# EAGLE design bbb-cc2520 (EAGLE 6.5.0)
AUTHOR: Neal Jackson; REV: B; TITLE: Zigbeag

## Sheet 1 of 5
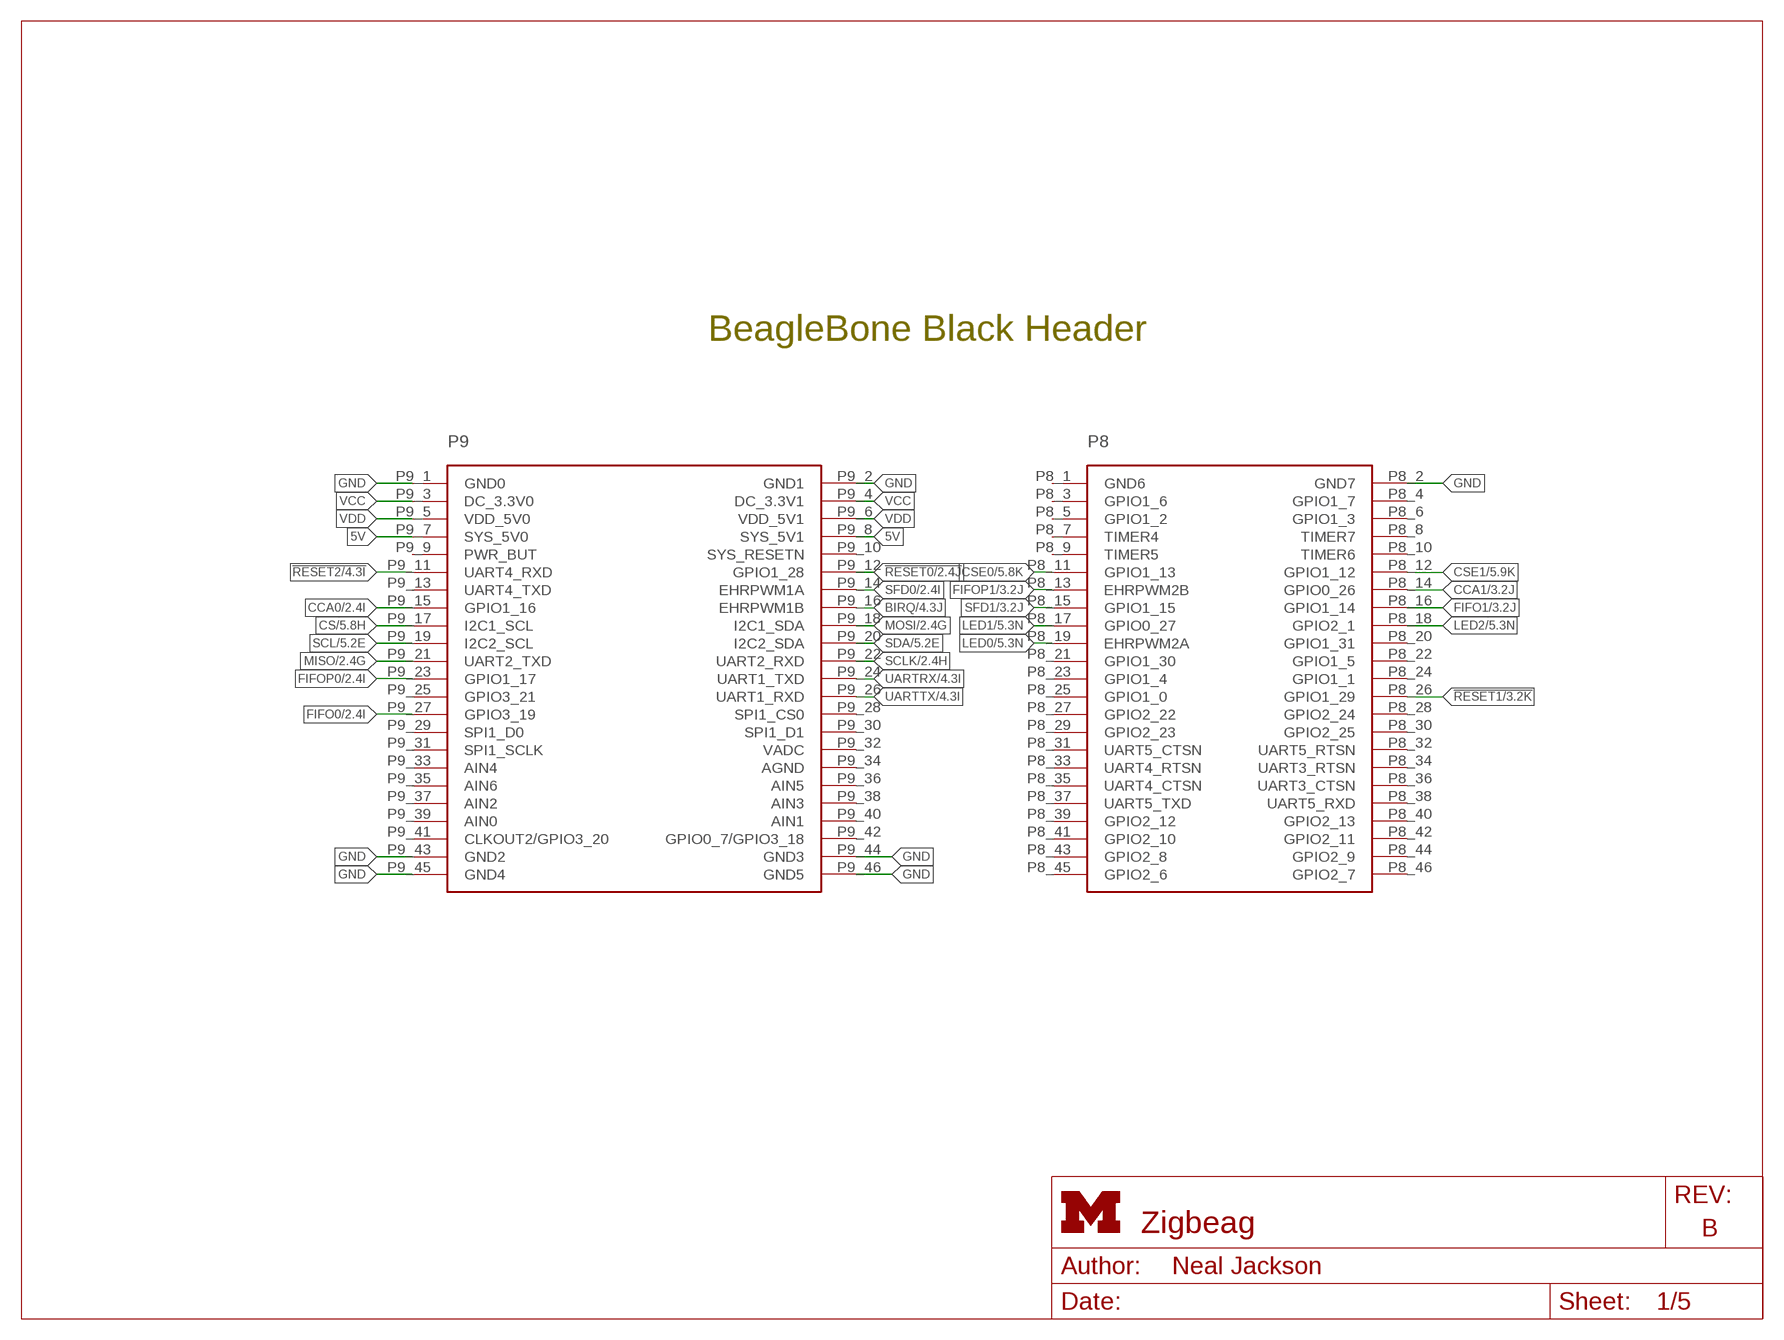
[diagram p0: schematic, sheet 1]
FRAME1 (LETTER_L): HEIGHT: 8.5in; WIDTH: 11in

### Parts
P9/P8  BBB_HEADERS  [BBB_HEADERS]

### Nets
5V: P9/P8.P9_7(SYS_5V0) P9/P8.P9_8(SYS_5V1)
!RESET0: P9/P8.P9_12(GPIO1_28) ; also sheet 2
!RESET1: P9/P8.P8_26(GPIO1_29) ; also sheet 3
!RESET2: P9/P8.P9_11(UART4_RXD) ; also sheet 4
BIRQ: P9/P8.P9_16(EHRPWM1B) ; also sheet 4
CCA0: P9/P8.P9_15(GPIO1_16) ; also sheet 2
CCA1: P9/P8.P8_14(GPIO0_26) ; also sheet 3
CS: P9/P8.P9_17(I2C1_SCL) ; also sheet 5
CSE0: P9/P8.P8_11(GPIO1_13) ; also sheet 5
CSE1: P9/P8.P8_12(GPIO1_12) ; also sheet 5
FIFO0: P9/P8.P9_27(GPIO3_19) ; also sheet 2
FIFO1: P9/P8.P8_16(GPIO1_14) ; also sheet 3
FIFOP0: P9/P8.P9_23(GPIO1_17) ; also sheet 2
FIFOP1: P9/P8.P8_13(EHRPWM2B) ; also sheet 3
GND: P9/P8.P8_2(GND7) P9/P8.P9_1(GND0) P9/P8.P9_2(GND1) P9/P8.P9_43(GND2) P9/P8.P9_44(GND3) P9/P8.P9_45(GND4) P9/P8.P9_46(GND5) ; also sheet 2,3,4,5
LED0: P9/P8.P8_19(EHRPWM2A) ; also sheet 5
LED1: P9/P8.P8_17(GPIO0_27) ; also sheet 5
LED2: P9/P8.P8_18(GPIO2_1) ; also sheet 5
MISO: P9/P8.P9_21(UART2_TXD) ; also sheet 2,3,4
MOSI: P9/P8.P9_18(I2C1_SDA) ; also sheet 2,3,4
SCL: P9/P8.P9_19(I2C2_SCL) ; also sheet 5
SCLK: P9/P8.P9_22(UART2_RXD) ; also sheet 2,3,4
SDA: P9/P8.P9_20(I2C2_SDA) ; also sheet 5
SFD0: P9/P8.P9_14(EHRPWM1A) ; also sheet 2
SFD1: P9/P8.P8_15(GPIO1_15) ; also sheet 3
UARTRX: P9/P8.P9_24(UART1_TXD) ; also sheet 4
UARTTX: P9/P8.P9_26(UART1_RXD) ; also sheet 4
VCC: P9/P8.P9_3(DC_3.3V0) P9/P8.P9_4(DC_3.3V1) ; also sheet 2,3,4,5
VDD: P9/P8.P9_5(VDD_5V0) P9/P8.P9_6(VDD_5V1)
Unconnected: P9/P8.P8_1(GND6) P9/P8.P8_3(GPIO1_6) P9/P8.P8_4(GPIO1_7) P9/P8.P8_5(GPIO1_2) P9/P8.P8_6(GPIO1_3) P9/P8.P8_7(TIMER4) P9/P8.P8_8(TIMER7) P9/P8.P8_9(TIMER5) P9/P8.P8_10(TIMER6) P9/P8.P8_20(GPIO1_31) P9/P8.P8_21(GPIO1_30) P9/P8.P8_22(GPIO1_5) P9/P8.P8_23(GPIO1_4) P9/P8.P8_24(GPIO1_1) P9/P8.P8_25(GPIO1_0) P9/P8.P8_27(GPIO2_22) P9/P8.P8_28(GPIO2_24) P9/P8.P8_29(GPIO2_23) P9/P8.P8_30(GPIO2_25) P9/P8.P8_31(UART5_CTSN) P9/P8.P8_32(UART5_RTSN) P9/P8.P8_33(UART4_RTSN) P9/P8.P8_34(UART3_RTSN) P9/P8.P8_35(UART4_CTSN) P9/P8.P8_36(UART3_CTSN) P9/P8.P8_37(UART5_TXD) P9/P8.P8_38(UART5_RXD) P9/P8.P8_39(GPIO2_12) P9/P8.P8_40(GPIO2_13) P9/P8.P8_41(GPIO2_10) P9/P8.P8_42(GPIO2_11) P9/P8.P8_43(GPIO2_8) P9/P8.P8_44(GPIO2_9) P9/P8.P8_45(GPIO2_6) P9/P8.P8_46(GPIO2_7) P9/P8.P9_9(PWR_BUT) P9/P8.P9_10(SYS_RESETN) P9/P8.P9_13(UART4_TXD) P9/P8.P9_25(GPIO3_21) P9/P8.P9_28(SPI1_CS0) P9/P8.P9_29(SPI1_D0) P9/P8.P9_30(SPI1_D1) P9/P8.P9_31(SPI1_SCLK) P9/P8.P9_32(VADC) P9/P8.P9_33(AIN4) P9/P8.P9_34(AGND) P9/P8.P9_35(AIN6) P9/P8.P9_36(AIN5) P9/P8.P9_37(AIN2) P9/P8.P9_38(AIN3) P9/P8.P9_39(AIN0) P9/P8.P9_40(AIN1) P9/P8.P9_41(CLKOUT2/GPIO3_20) P9/P8.P9_42(GPIO0_7/GPIO3_18)

### Notes on the sheet
- BeagleBone Black Header

## Sheet 2 of 5
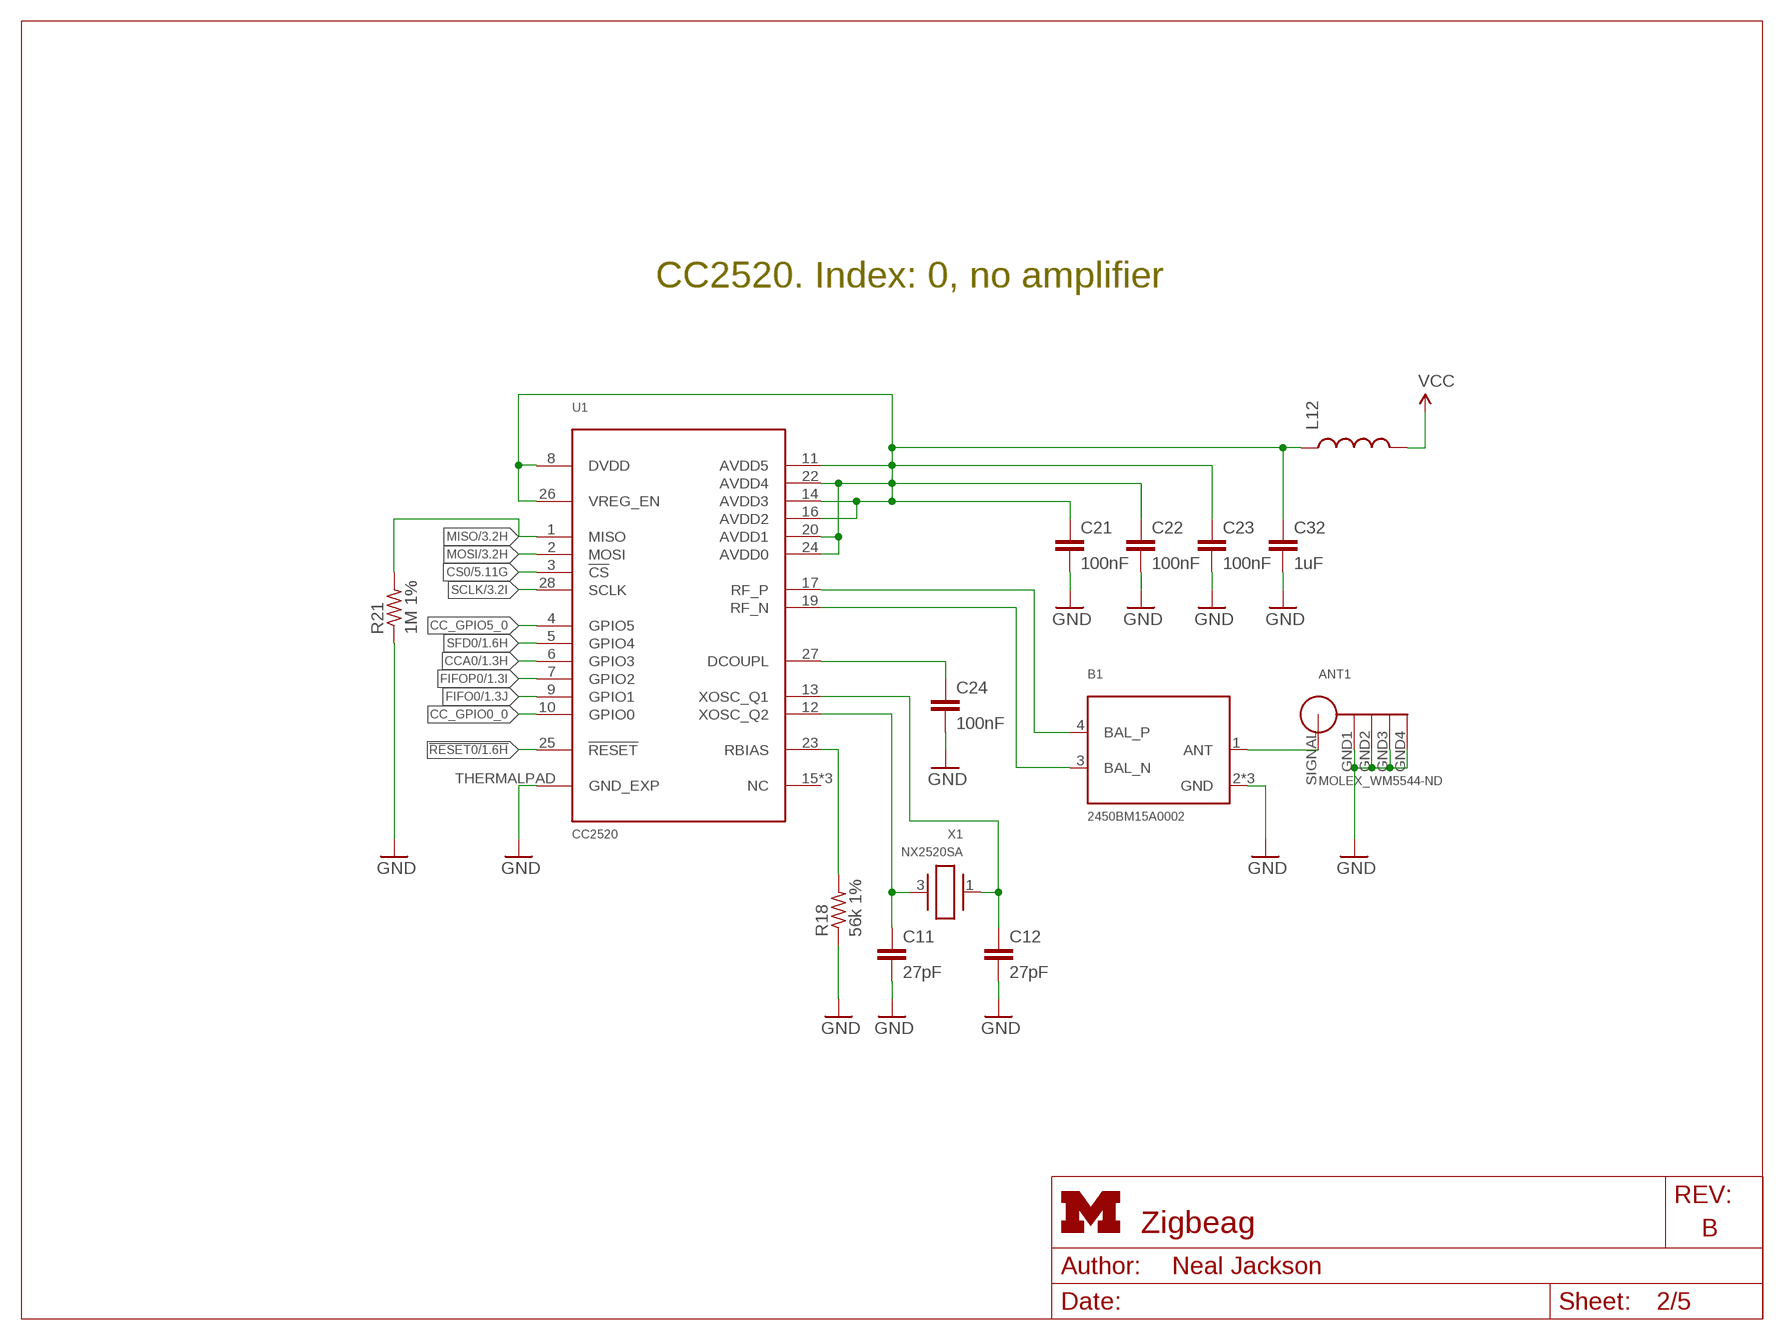
[diagram p1: schematic, sheet 2]
FRAME6 (LETTER_L): HEIGHT: 8.5in; WIDTH: 11in

### Parts
ANT1  MOLEX_WM5544-ND  [MOLEX_WM5544-ND]
B1  2450BM15A0002  [2450BM]
C11  27pF  C-EUC0402  [C0402]
C12  27pF  C-EUC0402  [C0402]
C21  100nF  C-EUC0402  [C0402]
C22  100nF  C-EUC0402  [C0402]
C23  100nF  C-EUC0402  [C0402]
C24  100nF  C-EUC0402  [C0402]
C32  1uF  C-EUC0603  [C0603]
L12  INDUCTOR0603  [0603]
R18  56k 1%  R-US_R0402  [R0402]
R21  1M 1%  R-US_R0402  [R0402]
U1  CC2520  [S-PVQFN-N28]
X1  NX2520SA  [NX2520SA]

### Nets
!RESET0: U1.25(!RESET) ; also sheet 1
CC_GPIO0_0: U1.10(GPIO0)
CC_GPIO5_0: U1.4(GPIO5)
CCA0: U1.6(GPIO3) ; also sheet 1
CS0: U1.3(!CS) ; also sheet 5
FIFO0: U1.9(GPIO1) ; also sheet 1
FIFOP0: U1.7(GPIO2) ; also sheet 1
GND: ANT1.GND1 ANT1.GND2 ANT1.GND3 ANT1.GND4 B1.2(GND) B1.5(GND) B1.6(GND) C11.2 C12.2 C21.2 C22.2 C23.2 C24.2 C32.2 R18.1 R21.1 U1.THERMALPAD(GND_EXP) ; also sheet 1,3,4,5
MISO: R21.2 U1.1(MISO) ; also sheet 1,3,4
MOSI: U1.2(MOSI) ; also sheet 1,3,4
N$5: C21.1 C22.1 C23.1 C32.1 L12.1 U1.8(DVDD) U1.11(AVDD5) U1.14(AVDD3) U1.16(AVDD2) U1.20(AVDD1) U1.22(AVDD4) U1.24(AVDD0) U1.26(VREG_EN)
N$7: ANT1.SIGNAL B1.1(ANT)
N$11: C12.1 U1.13(XOSC_Q1) X1.1
N$12: C24.1 U1.27(DCOUPL)
N$13: C11.1 U1.12(XOSC_Q2) X1.3
N$14: R18.2 U1.23(RBIAS)
RF_N: B1.3(BAL_N) U1.19(RF_N)
RF_P: B1.4(BAL_P) U1.17(RF_P)
SCLK: U1.28(SCLK) ; also sheet 1,3,4
SFD0: U1.5(GPIO4) ; also sheet 1
VCC: L12.2 ; also sheet 1,3,4,5
Unconnected: U1.15(NC) U1.18(NC) U1.21(NC)

### Notes on the sheet
- CC2520. Index: 0, no amplifier

## Sheet 3 of 5
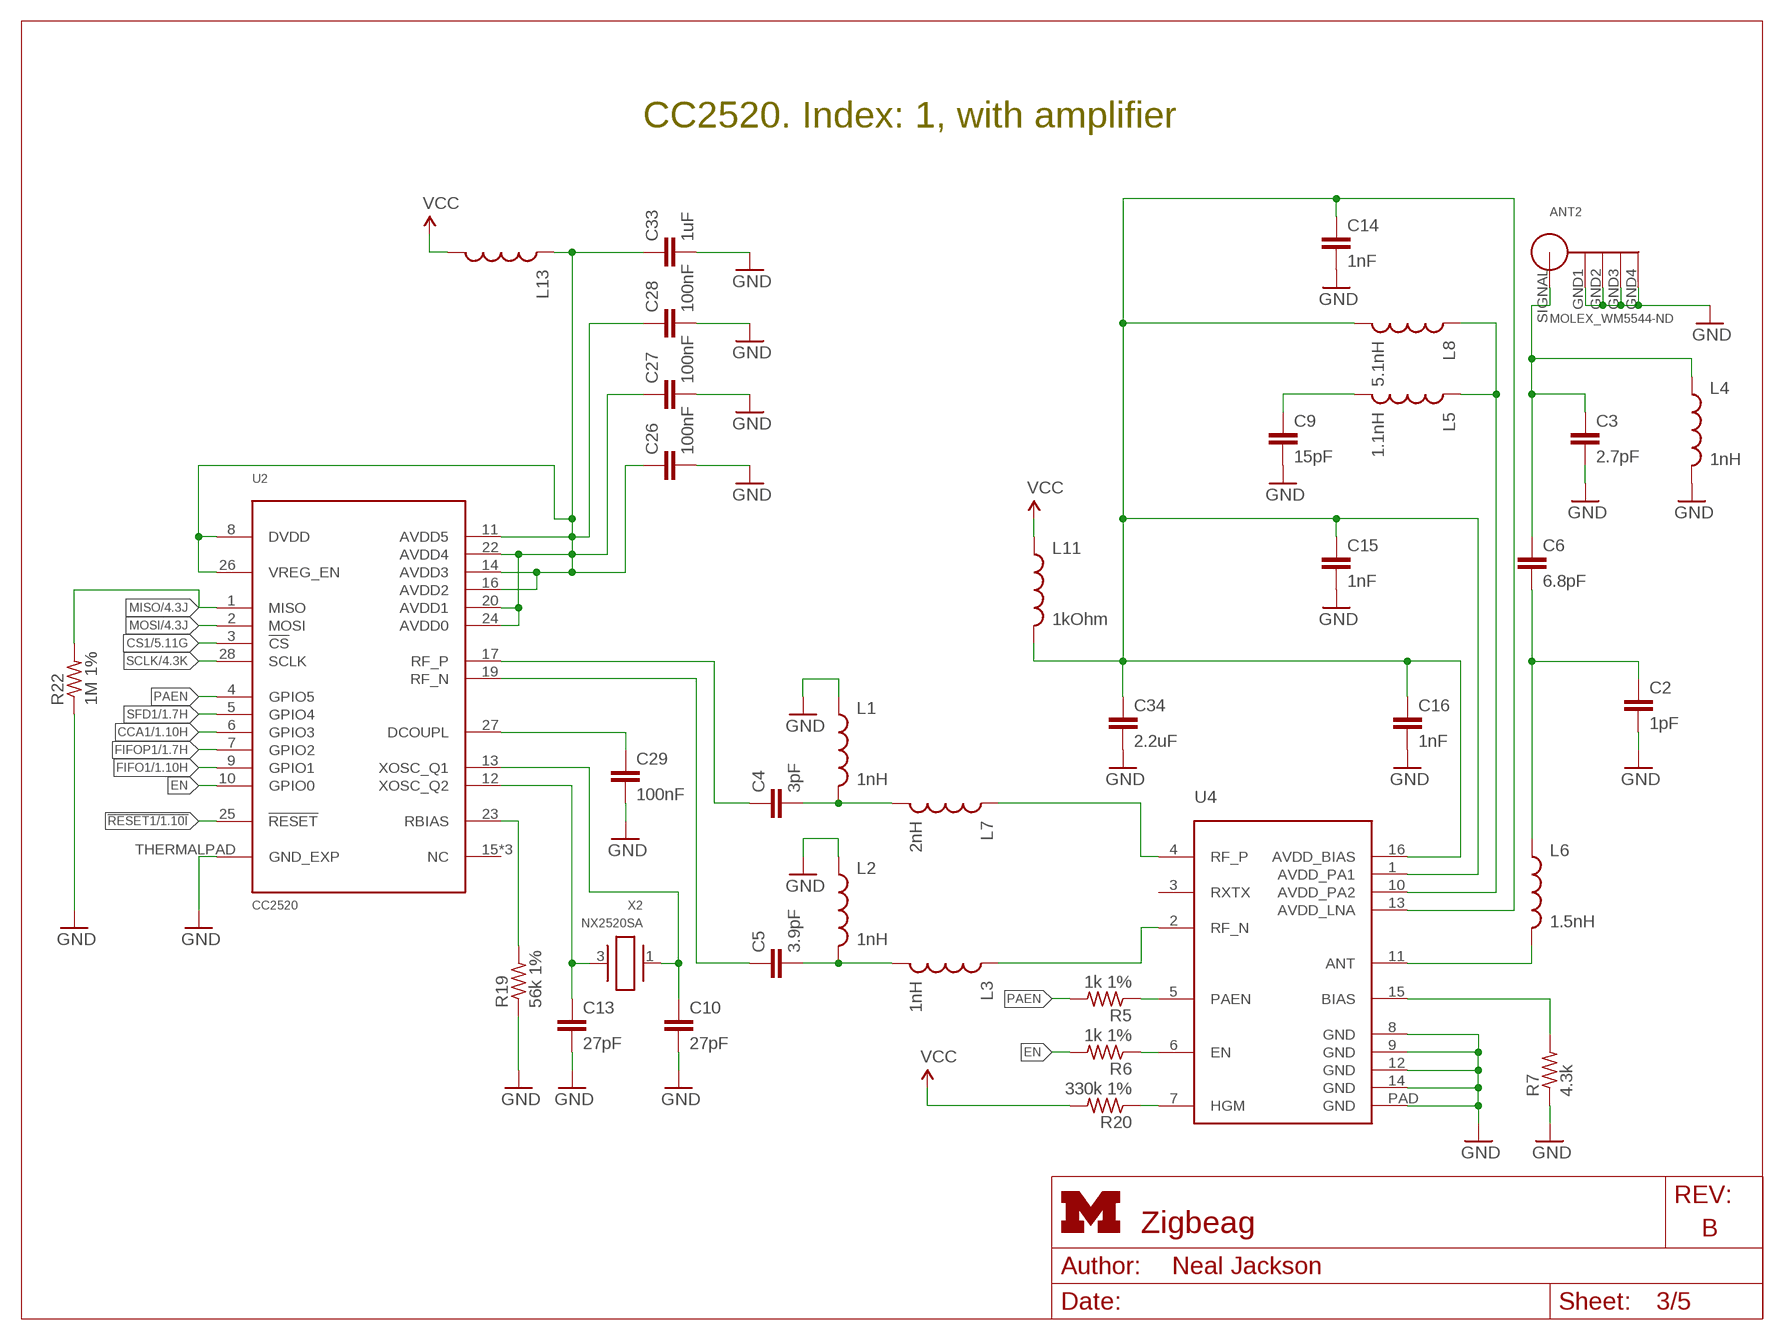
[diagram p2: schematic, sheet 3]
FRAME3 (LETTER_L): HEIGHT: 8.5in; WIDTH: 11in

### Parts
ANT2  MOLEX_WM5544-ND  [MOLEX_WM5544-ND]
C2  1pF  C-EUC0402  [C0402]
C3  2.7pF  C-EUC0402  [C0402]
C4  3pF  C-EUC0402  [C0402]
C5  3.9pF  C-EUC0402  [C0402]
C6  6.8pF  C-EUC0402  [C0402]
C9  15pF  C-EUC0402  [C0402]
C10  27pF  C-EUC0402  [C0402]
C13  27pF  C-EUC0402  [C0402]
C14  1nF  C-EUC0402  [C0402]
C15  1nF  C-EUC0402  [C0402]
C16  1nF  C-EUC0402  [C0402]
C26  100nF  C-EUC0402  [C0402]
C27  100nF  C-EUC0402  [C0402]
C28  100nF  C-EUC0402  [C0402]
C29  100nF  C-EUC0402  [C0402]
C33  1uF  C-EUC0603  [C0603]
C34  2.2uF  C-EUC0402  [C0402]
L1  1nH  INDUCTOR0402  [C0402]
L2  1nH  INDUCTOR0402  [C0402]
L3  1nH  INDUCTOR0402  [C0402]
L4  1nH  INDUCTOR0402  [C0402]
L5  1.1nH  INDUCTOR0402  [C0402]
L6  1.5nH  INDUCTOR0402  [C0402]
L7  2nH  INDUCTOR0402  [C0402]
L8  5.1nH  INDUCTOR0402  [C0402]
L11  1kOhm  INDUCTOR0402  [C0402]
L13  INDUCTOR0603  [0603]
R5  1k 1%  R-US_R0402  [R0402]
R6  1k 1%  R-US_R0402  [R0402]
R7  4.3k  R-US_R0402  [R0402]
R19  56k 1%  R-US_R0402  [R0402]
R20  330k 1%  R-US_R0402  [R0402]
R22  1M 1%  R-US_R0402  [R0402]
U2  CC2520  [S-PVQFN-N28]
U4  CC2591  [PVQFN-16]
X2  NX2520SA  [NX2520SA]

### Nets
!RESET1: U2.25(!RESET) ; also sheet 1
CCA1: U2.6(GPIO3) ; also sheet 1
CS1: U2.3(!CS) ; also sheet 5
EN: R6.2 U2.10(GPIO0)
FIFO1: U2.9(GPIO1) ; also sheet 1
FIFOP1: U2.7(GPIO2) ; also sheet 1
GND: ANT2.GND1 ANT2.GND2 ANT2.GND3 ANT2.GND4 C2.2 C3.2 C9.2 C10.2 C13.2 C14.2 C15.2 C16.2 C26.2 C27.2 C28.2 C29.2 C33.2 C34.2 L1.1 L2.1 L4.2 R7.1 R19.1 R22.1 U2.THERMALPAD(GND_EXP) U4.8(GND) U4.9(GND) U4.12(GND) U4.14(GND) U4.PAD(GND) ; also sheet 1,2,4,5
MISO: R22.2 U2.1(MISO) ; also sheet 1,2,4
MOSI: U2.2(MOSI) ; also sheet 1,2,4
N$44: L7.1 U4.4(RF_P)
N$45: L3.1 U4.2(RF_N)
N$46: C5.2 L2.2 L3.2
N$47: C4.2 L1.2 L7.2
N$48: L5.1 L8.1 U4.10(AVDD_PA2)
N$49: C14.1 C15.1 C16.1 C34.1 L8.2 L11.2 U4.1(AVDD_PA1) U4.13(AVDD_LNA) U4.16(AVDD_BIAS)
N$50: C9.1 L5.2
N$51: L6.2 U4.11(ANT)
N$52: ANT2.SIGNAL C3.1 C6.1 L4.1
N$53: C2.1 C6.2 L6.1
N$54: R7.2 U4.15(BIAS)
N$55: R5.1 U4.5(PAEN)
N$56: R6.1 U4.6(EN)
N$57: C26.1 C27.1 C28.1 C33.1 L13.1 U2.8(DVDD) U2.11(AVDD5) U2.14(AVDD3) U2.16(AVDD2) U2.20(AVDD1) U2.22(AVDD4) U2.24(AVDD0) U2.26(VREG_EN)
N$58: C29.1 U2.27(DCOUPL)
N$59: C10.1 U2.13(XOSC_Q1) X2.1
N$60: C13.1 U2.12(XOSC_Q2) X2.3
N$61: R19.2 U2.23(RBIAS)
N$62: R20.1 U4.7(HGM)
PAEN: R5.2 U2.4(GPIO5)
RF_N2: C5.1 U2.19(RF_N)
RF_P2: C4.1 U2.17(RF_P)
SCLK: U2.28(SCLK) ; also sheet 1,2,4
SFD1: U2.5(GPIO4) ; also sheet 1
VCC: L11.1 L13.2 R20.2 ; also sheet 1,2,4,5
Unconnected: U2.15(NC) U2.18(NC) U2.21(NC) U4.3(RXTX)

### Notes on the sheet
- CC2520. Index: 1, with amplifier

## Sheet 4 of 5
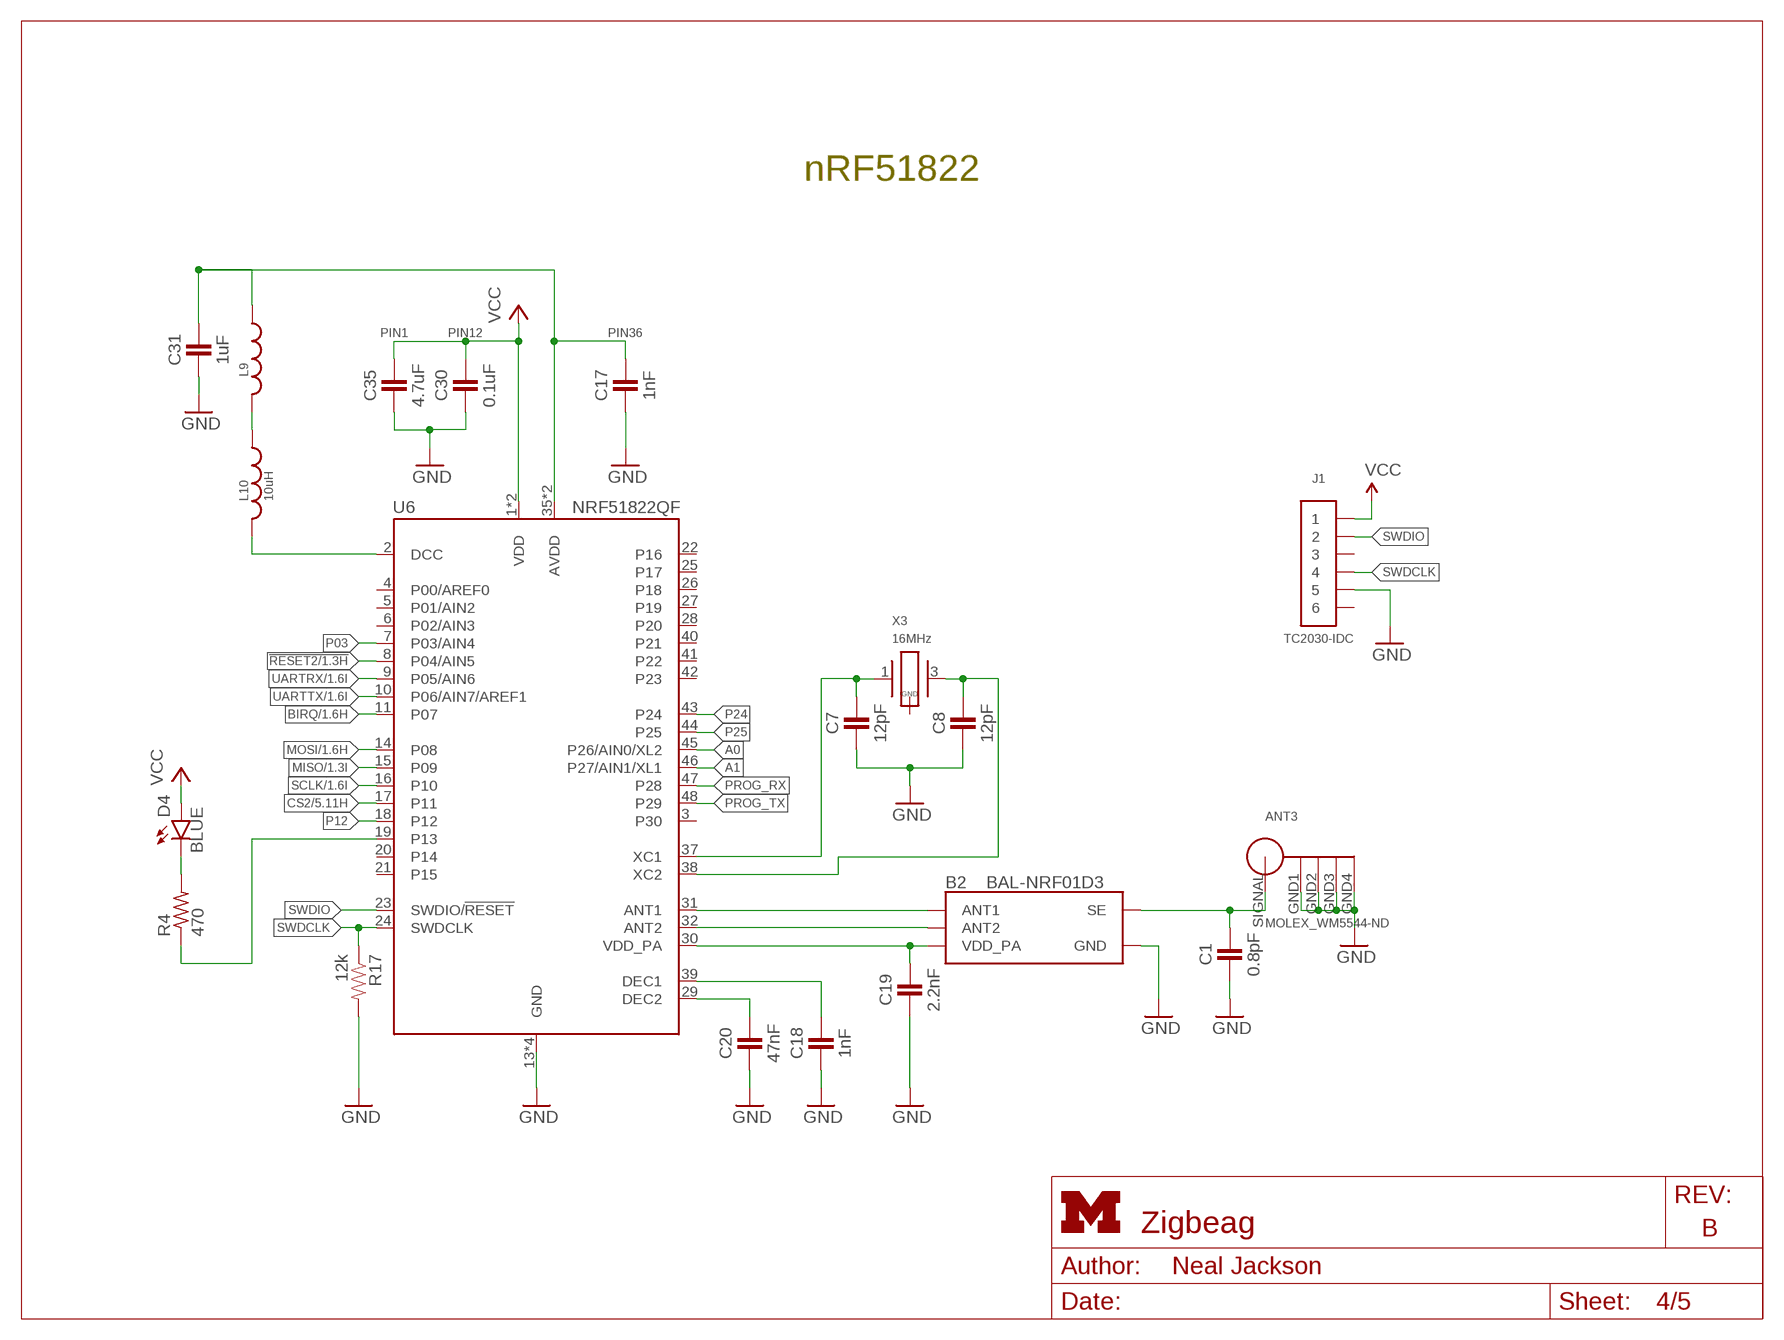
[diagram p3: schematic, sheet 4]
FRAME2 (LETTER_L): HEIGHT: 8.5in; WIDTH: 11in

### Parts
ANT3  MOLEX_WM5544-ND  [MOLEX_WM5544-ND]
B2  BAL-NRF01D3  [BAL-NRF01D3]
C1  0.8pF  CAPACITOR  [0402_CAP]
C7  12pF  CAPACITOR  [0402_CAP]
C8  12pF  CAPACITOR  [0402_CAP]
C17  1nF  CAPACITOR  [0402_CAP]
C18  1nF  CAPACITOR  [0402_CAP]
C19  2.2nF  CAPACITOR  [0402_CAP]
C20  47nF  CAPACITOR  [0402_CAP]
C30  0.1uF  CAPACITOR  [0402_CAP]
C31  1uF  CAPACITOR  [0402_CAP]
C35  4.7uF  CAPACITOR  [0402_CAP]
D4  BLUE  LED0603  [LED-0603]
J1  TC2030-IDC  [TC2030-IDC]
L9  INDUCTOR0402  [0402_CAP]
L10  10uH  INDUCTOR0603  [0603_CAP]
R4  470  R-US_R0402  [R0402]
R17  12k  RESISTOR  [0603-RES]
U6  NRF51822QF  [QFN-48-6MM]
X3  16MHz  TXC-8Y  [TXC-8Y]

### Nets
!RESET2: U6.8(P04/AIN5) ; also sheet 1
A0: U6.45(P26/AIN0/XL2)
A1: U6.46(P27/AIN1/XL1)
AVDD: C17.1 C31.1 L9.1 U6.35(AVDD) U6.36(AVDD)
BIRQ: U6.11(P07) ; also sheet 1
CS2: U6.17(P11) ; also sheet 5
DCC: L10.2 U6.2(DCC)
GND: ANT3.GND1 ANT3.GND2 ANT3.GND3 ANT3.GND4 B2.GND C1.2 C7.2 C8.2 C17.2 C18.2 C19.2 C20.2 C30.2 C31.2 C35.2 J1.5 R17.2 U6.13(GND) U6.33(GND) U6.34(GND) U6.GND ; also sheet 1,2,3,5
MISO: U6.15(P09) ; also sheet 1,2,3
MOSI: U6.14(P08) ; also sheet 1,2,3
N$36: B2.ANT1 U6.31(ANT1)
N$37: B2.ANT2 U6.32(ANT2)
N$38: ANT3.SIGNAL B2.SE C1.1
N$39: L9.2 L10.1
N$40: C7.1 U6.37(XC1) X3.1
N$41: C8.1 U6.38(XC2) X3.3
N$42: C18.1 U6.39(DEC1)
N$43: C20.1 U6.29(DEC2)
N$63: D4.C R4.2
N$64: R4.1 U6.19(P13)
P03: U6.7(P03/AIN4)
P12: U6.18(P12)
P24: U6.43(P24)
P25: U6.44(P25)
PROG_RX: U6.47(P28)
PROG_TX: U6.48(P29)
SCLK: U6.16(P10) ; also sheet 1,2,3
SWDCLK: J1.4 R17.1 U6.24(SWDCLK)
SWDIO: J1.2 U6.23(SWDIO/!RESET)
UARTRX: U6.9(P05/AIN6) ; also sheet 1
UARTTX: U6.10(P06/AIN7/AREF1) ; also sheet 1
VCC: C30.1 C35.1 D4.A J1.1 U6.1(VDD) U6.12(VDD) ; also sheet 1,2,3,5
VDD_PA: B2.VCC(VDD_PA) C19.1 U6.30(VDD_PA)
Unconnected: J1.3 J1.6 U6.3(P30) U6.4(P00/AREF0) U6.5(P01/AIN2) U6.6(P02/AIN3) U6.20(P14) U6.21(P15) U6.22(P16) U6.25(P17) U6.26(P18) U6.27(P19) U6.28(P20) U6.40(P21) U6.41(P22) U6.42(P23) X3.2(GND) X3.4(GND)

### Notes on the sheet
- nRF51822
- PIN1 | PIN12 | PIN36

## Sheet 5 of 5
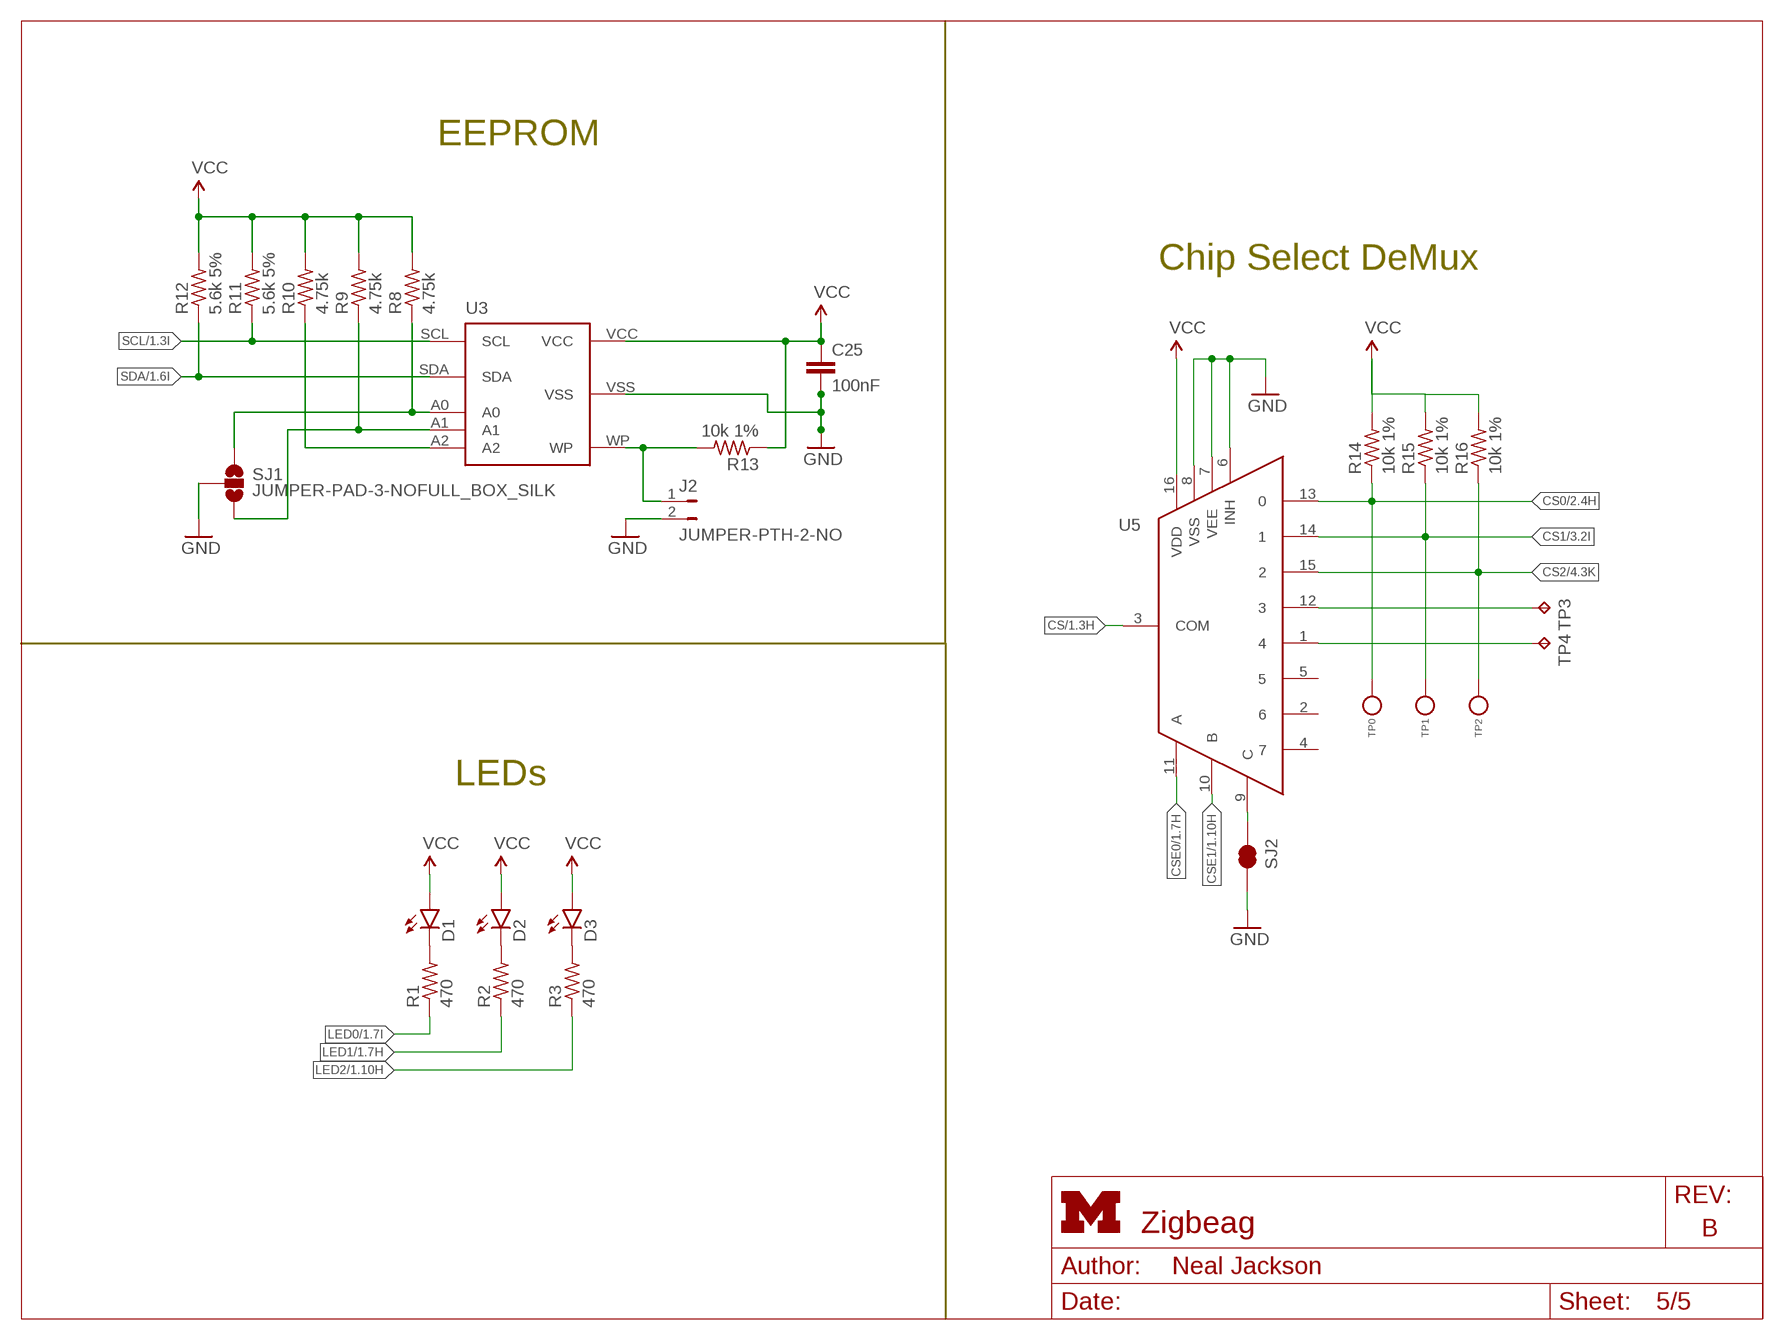
[diagram p4: schematic, sheet 5]
FRAME4 (LETTER_L): HEIGHT: 8.5in; WIDTH: 11in

### Parts
C25  100nF  C-EUC0402  [C0402]
D1  LED0603  [LED-0603]
D2  LED0603  [LED-0603]
D3  LED0603  [LED-0603]
J2  JUMPER-PTH-2-NO  [PTH-JUMPER-2-NO_NO_SILK]
R1  470  R-US_R0402  [R0402]
R2  470  R-US_R0402  [R0402]
R3  470  R-US_R0402  [R0402]
R8  4.75k  R-US_R0402  [R0402]
R9  4.75k  R-US_R0402  [R0402]
R10  4.75k  R-US_R0402  [R0402]
R11  5.6k 5%  R-US_R0402  [R0402]
R12  5.6k 5%  R-US_R0402  [R0402]
R13  10k 1%  R-US_R0402  [R0402]
R14  10k 1%  R-US_R0402  [R0402]
R15  10k 1%  R-US_R0402  [R0402]
R16  10k 1%  R-US_R0402  [R0402]
SJ1  JUMPER-PAD-3-NOFULL_BOX_SILK  [PAD-JUMPER-3-NO_YES_SILK_FULL_BOX]
SJ2  JUMPER-PAD-2-NC_BY_TRACE  [PAD-JUMPER-2-NC_BY_TRACE_YES_SILK]
TP0  TEST_POINT_0.040IN  [TESTPOINT_0.040IN]
TP1  TEST_POINT_0.040IN  [TESTPOINT_0.040IN]
TP2  TEST_POINT_0.040IN  [TESTPOINT_0.040IN]
TP3  TPTP14SQ  [TP14SQ]
TP4  TPTP14SQ  [TP14SQ]
U3  CAT24C256WI-GT3  [CAT24C256WI-GT3]
U5  CD4051B-53B  [TSSOP16]

### Nets
CS: U5.3(COM) ; also sheet 1
CS0: R14.1 TP0.TESTPOINT U5.13 ; also sheet 2
CS1: R15.1 TP1.TESTPOINT U5.14 ; also sheet 3
CS2: R16.1 TP2.TESTPOINT U5.15 ; also sheet 4
CSE0: U5.11(A) ; also sheet 1
CSE1: U5.10(B) ; also sheet 1
GND: C25.2 J2.2 SJ1.2 SJ2.2 U3.VSS U5.6(INH) U5.7(VEE) U5.8(VSS) ; also sheet 1,2,3,4
LED0: R1.1 ; also sheet 1
LED1: R2.1 ; also sheet 1
LED2: R3.1 ; also sheet 1
N$1: D1.C R1.2
N$2: D2.C R2.2
N$3: D3.C R3.2
N$29: R8.1 SJ1.1 U3.A0
N$30: R9.1 SJ1.3 U3.A1
N$31: J2.1 R13.2 U3.WP
N$32: R10.1 U3.A2
N$65: SJ2.1 U5.9(C)
N$66: TP3.TP U5.12
N$67: TP4.TP U5.1
SCL: R11.1 U3.SCL ; also sheet 1
SDA: R12.1 U3.SDA ; also sheet 1
VCC: C25.1 D1.A D2.A D3.A R8.2 R9.2 R10.2 R11.2 R12.2 R13.1 R14.2 R15.2 R16.2 U3.VCC U5.16(VDD) ; also sheet 1,2,3,4
Unconnected: U5.2 U5.4 U5.5

### Notes on the sheet
- EEPROM
- Chip Select DeMux
- LEDs

## Library data of the parts
ANT1-ANT3 = connector:MOLEX_WM5544-ND: Through-hole SMA Antenna; DIGIKEY: WM5544-ND
B1 = rpi-cc2520:2450BM15A0002: BALUN JTI MATCHED ZIGBEE; DIGIKEY: 712-1536-1-ND
B2 = chips:BAL-NRF01D3: 50 ohm nominal input / conjugate match balun to nRF51422-QFAA, nRF24LE1, nRF51822-QFAA/AB, with integrated harmonic filter; DIGIKEY: 497-13637-1-ND; MOUSER: 511-BAL-NRF01D3
C1 C19 = passives:CAPACITOR: 0402 Capacitor; DIGIKEY: 490-5419-1-ND
C2-C6 C9 C14-C16 C21-C29 C34 = rcl:C-EU: CAPACITOR, European symbol; DIGIKEY: 490-1318-1-ND
C7 C8 = passives:CAPACITOR: 0402 Capacitor; DIGIKEY: 490-6197-1-ND
C10-C13 = rcl:C-EU: CAPACITOR, European symbol; DIGIKEY: 490-5869-1-ND
C17 C18 = passives:CAPACITOR: 0402 Capacitor; DIGIKEY: 490-1303-1-ND
C20 = passives:CAPACITOR: 0402 Capacitor; DIGIKEY: 445-1264-1-ND
C30 = passives:CAPACITOR: 0402 Capacitor; DIGIKEY: 445-4952-1-ND
C31 = passives:CAPACITOR: 0402 Capacitor; DIGIKEY: 1276-1513-1-ND
C32 C33 = rcl:C-EU: CAPACITOR, European symbol; DIGIKEY: 490-1550-1-ND
C35 = passives:CAPACITOR: 0402 Capacitor; DIGIKEY: 445-5947-1-ND
D1 = SparkFun-LED:LED: LEDs Standard schematic elements and footprints for 5mm, 3mm, 1206, and 0603 sized LEDs. 5mm - Spark Fun Electronics SKU : COM-00529 (and others); DIGIKEY: 160-1834-1-ND
D2 = SparkFun-LED:LED: LEDs Standard schematic elements and footprints for 5mm, 3mm, 1206, and 0603 sized LEDs. 5mm - Spark Fun Electronics SKU : COM-00529 (and others); DIGIKEY: 160-1835-1-ND
D3 = SparkFun-LED:LED: LEDs Standard schematic elements and footprints for 5mm, 3mm, 1206, and 0603 sized LEDs. 5mm - Spark Fun Electronics SKU : COM-00529 (and others); DIGIKEY: 160-1837-1-ND
D4 = SparkFun-LED:LED: LEDs Standard schematic elements and footprints for 5mm, 3mm, 1206, and 0603 sized LEDs. 5mm - Spark Fun Electronics SKU : COM-00529 (and others)
J1 = connector:TC2030-IDC: The TC2030-IDC is our "Legged" 6-pin Plug-of-Nailstm Cable fitted with a 6-pin 0.1" pitch ribbon connector.; TAGCONNECT: TC2030-IDC
J2 = SparkFun-Passives:JUMPER-PTH-2-NO
L1-L8 L11 = SparkFun-Passives:INDUCTOR: Inductors Basic Inductor/Choke - 0603 and 1206. Footprints are not proven and vary greatly between part numbers.
L9 = passives:INDUCTOR; DIGIKEY: 587-1521-1-ND
L10 = passives:INDUCTOR; DIGIKEY: 490-4025-1-ND
L12 L13 = SparkFun-Passives:INDUCTOR: Inductors Basic Inductor/Choke - 0603 and 1206. Footprints are not proven and vary greatly between part numbers.; DIGIKEY: 490-1015-1-ND
P9/P8 = bbb-cc2520:BBB_HEADERS: Pin Header 2x23
R1-R4 = rcl:R-US_: RESISTOR, American symbol; DIGIKEY: RHM470JCT-ND
R5-R7 R18-R20 = rcl:R-US_: RESISTOR, American symbol; DIGIKEY: P56.0KLCT-ND
R8-R16 R21 R22 = rcl:R-US_: RESISTOR, American symbol; DIGIKEY: RHM1.00MCDCT-ND
R17 = passives:RESISTOR: Resistor Basic schematic elements and footprints for 0603, 1206, and PTH resistors.; DIGIKEY: RHM12.0KCDCT-ND
SJ1 = SparkFun-Passives:JUMPER-PAD-3-NO
SJ2 = SparkFun-Passives:JUMPER-PAD-2-NC_BY_TRACE
TP0 TP1 TP2 = headers:TEST_POINT_0.040IN: 0.040in Test Point; DIGIKEY: 5001K-ND
TP3 TP4 = testpad:TP: Test pad
U1 U2 = chips:CC2520: 2.4 GHZ IEEE 802.15.4/ZIGBEE® RF TRANSCEIVER; DIGIKEY: 296-22996-1-ND
U3 = bbb-cc2520:CAT24C256: 256kb Serial CMOS EEPROM, organized as 32,768 words of 8 bits each
U4 = bbb-cc2520:CC2591
U5 = bbb-cc2520:CD4051B-53B: IC MUX/DEMUX 8x1 16TSSOP; DIGIKEY: 296-11993-1-ND
U6 = chips:NRF51822: Multiprotocol Bluetooth® 4.0 low energy/2.4 GHz RF SoC; DIGIKEY: 1490-1032-1-ND; MOUSER: 949-NRF51822-QFAB-R7
X1 X2 = rpi-cc2520:NX2520SA: CRYSTAL 32MHZ 10PF SMD; DIGIKEY: 644-1065-1-ND
X3 = crystals:TXC-8Y: 2mmx1.6mm SMD Crystal; DIGIKEY: 887-2003-1-ND

## Board
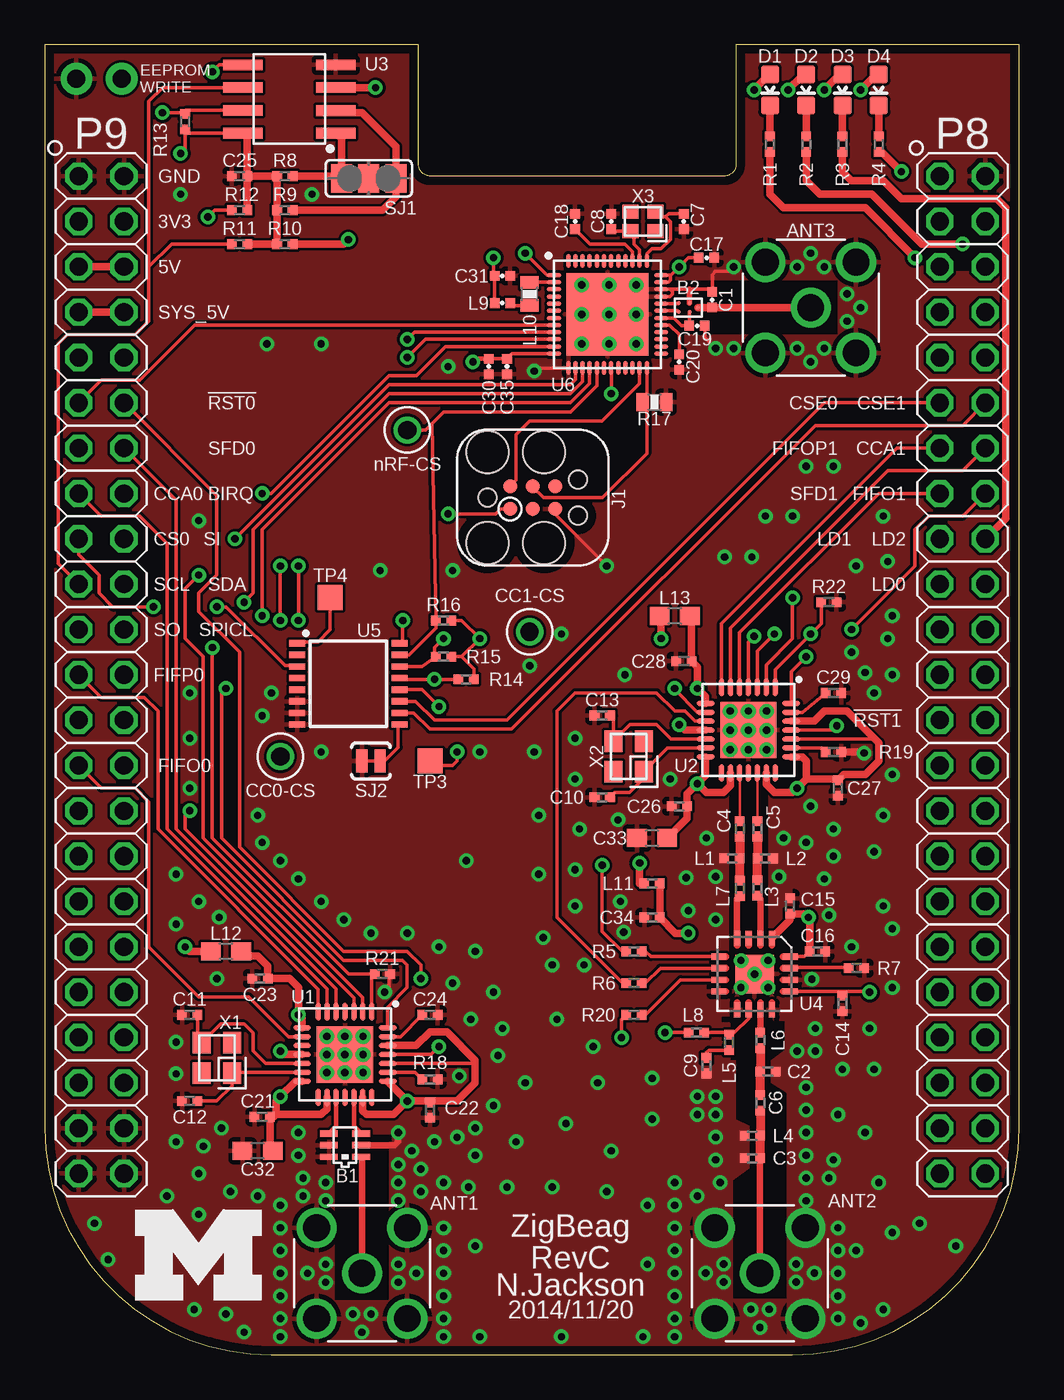
[diagram p5: board, top side]
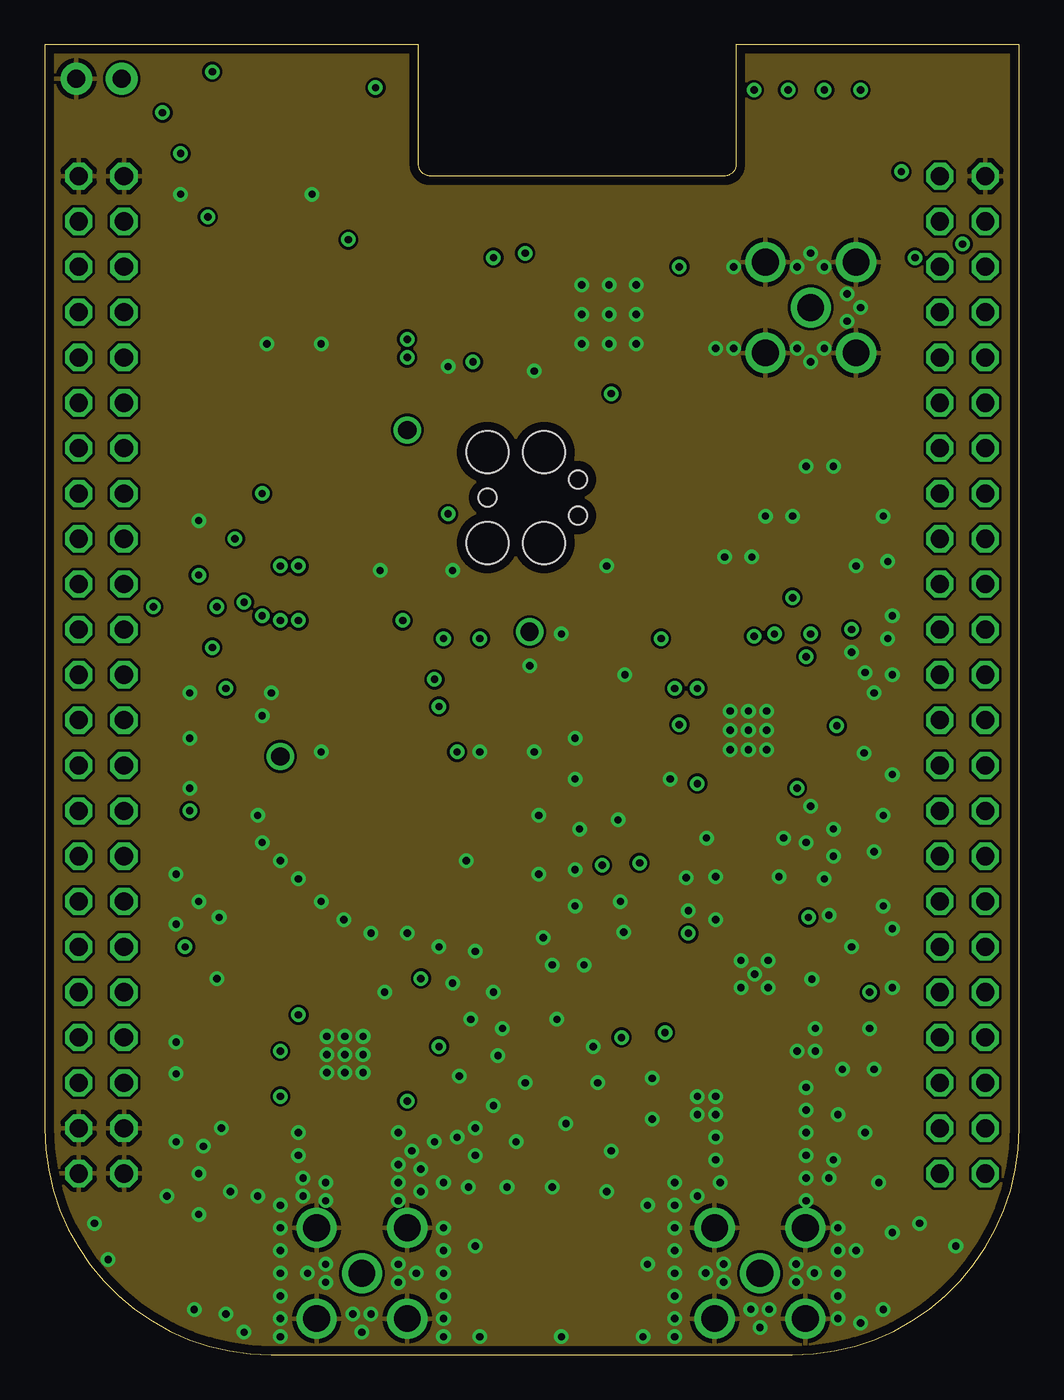
[diagram p6: board, inner layer GND]
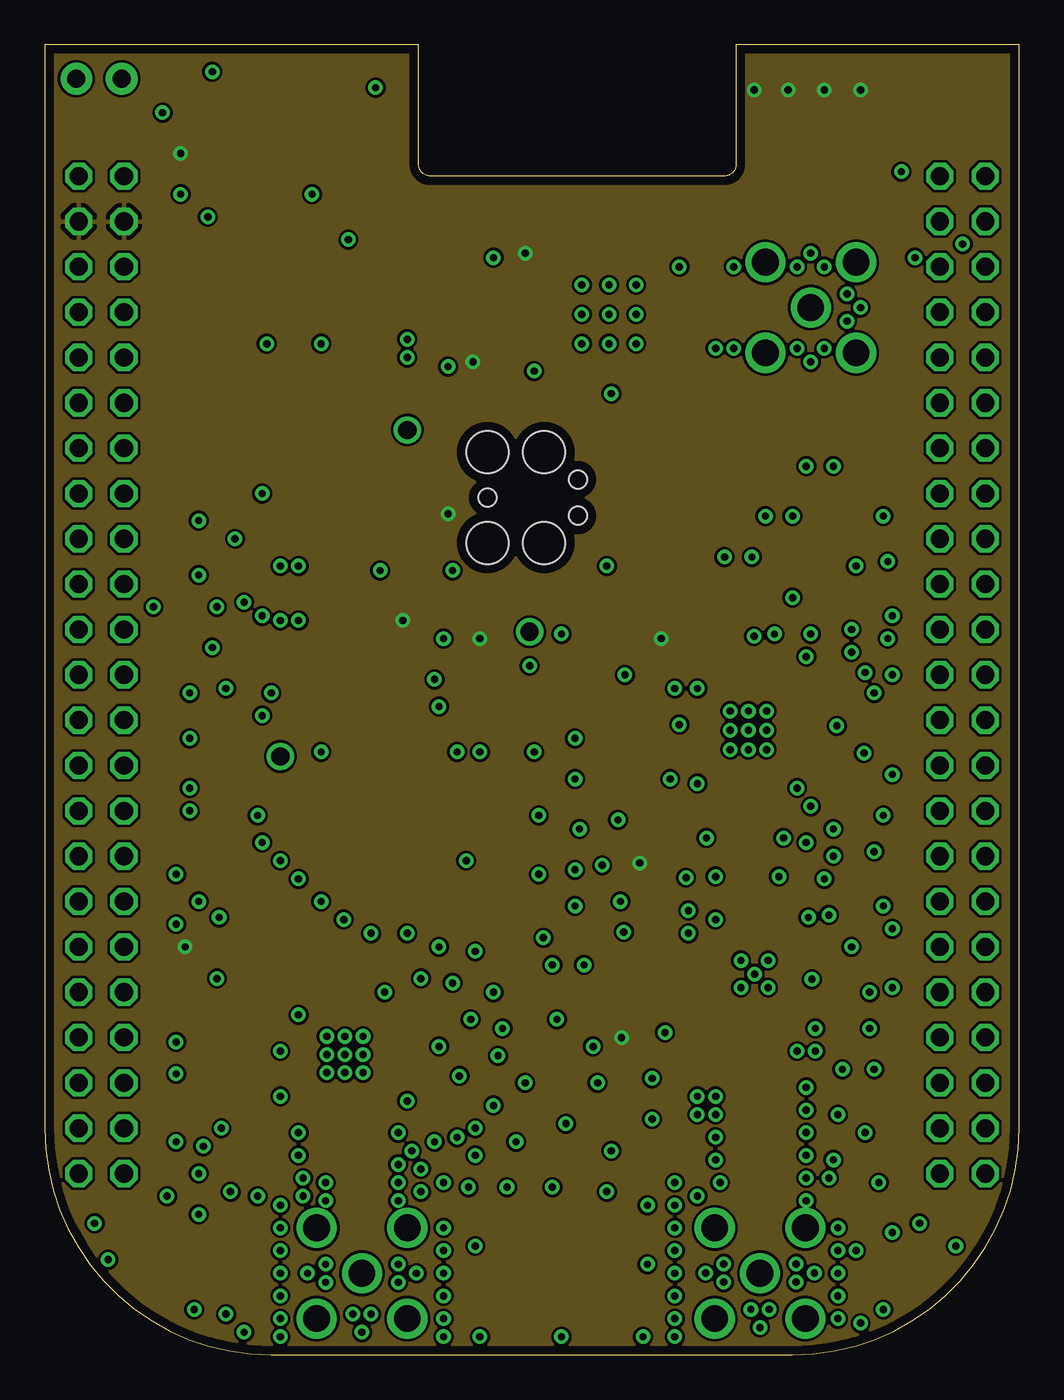
[diagram p7: board, inner layer VCC]
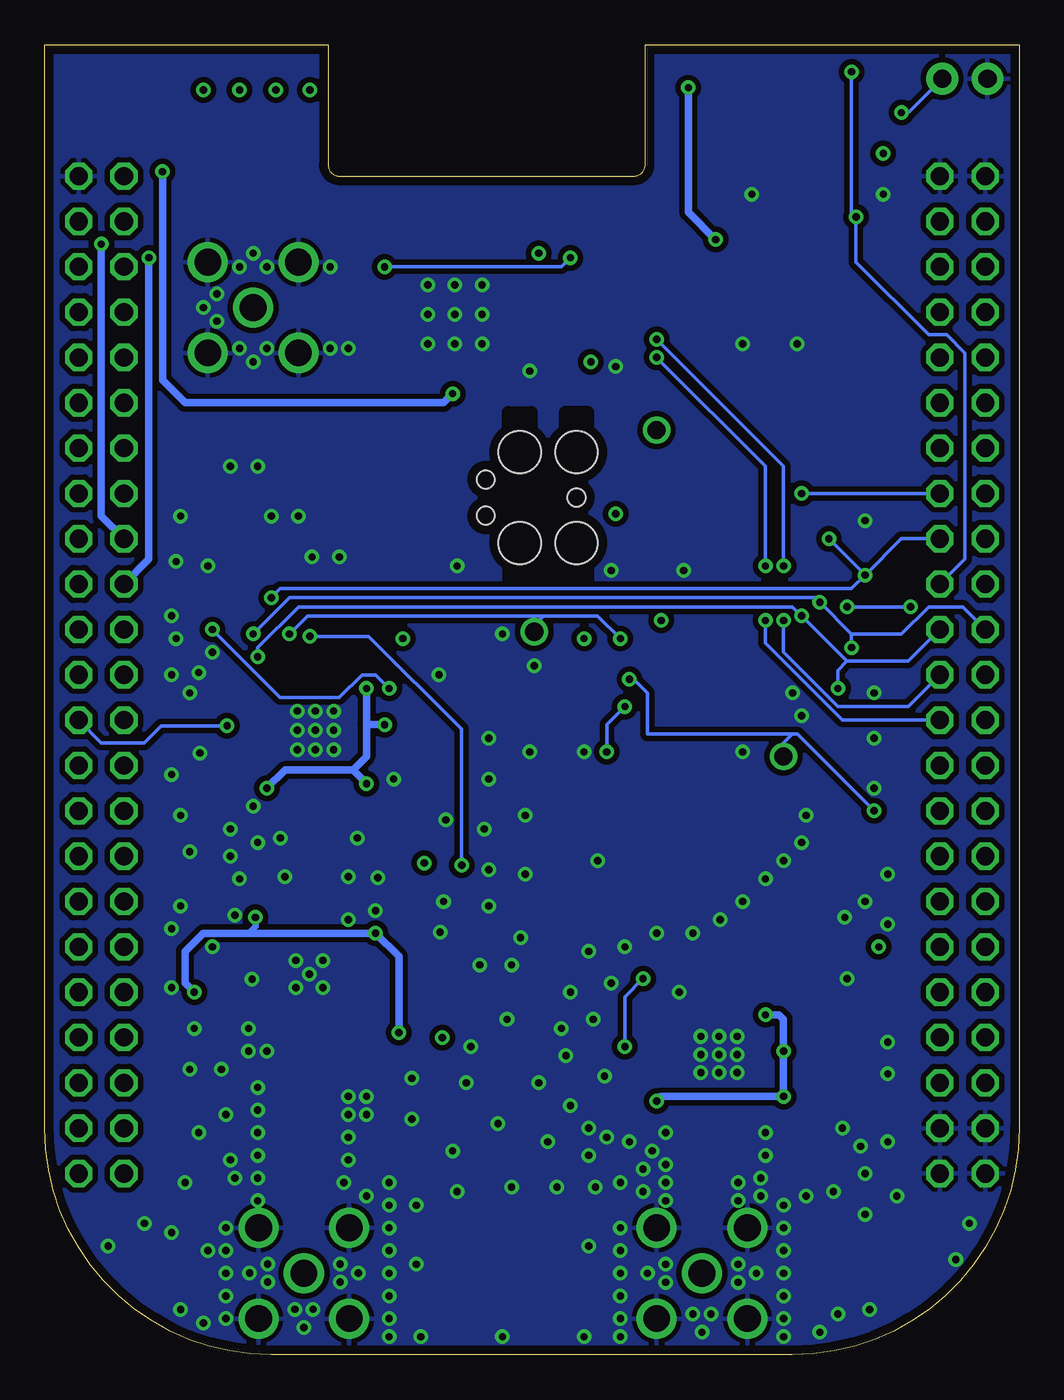
[diagram p8: board, bottom side, seen from below]

Size 54.61 x 73.41 mm. Coordinates in mm from the lower left corner, seen from the top.
Outline: 0,73.41 0,12.7 arc90 12.7,0 41.91,0 arc90 54.61,12.7 54.61,73.41 38.73,73.41 38.73,66.67 arc-90 38.1,66.04 21.59,66.04 arc-90 20.95,66.67 20.95,73.41 0,73.41
Copper layers (1+2*15+16): Top 0.0178mm / dielectric 12mil / GND 0.0356mm / dielectric 28mil / VCC 0.0356mm / dielectric 12mil / Bottom 0.0178mm
Design rules "sunstone-4lyr_v1.0.0.3 *": minimum track width 6mil, minimum drill 8mil, track to track 6mil, track to pad 6mil, pad to pad 6mil, via to via 6mil, smd to smd 6mil, copper to edge 20mil, drill to drill 16mil, minimum pad ring 8mil, minimum via ring 8mil, stop-mask expansion 3mil, vias tented up to drill 25mil, thermal gap 10mil

### Footprints (pad centres in the part's own frame; a part is rotated, then mirrored left to right if it is on the bottom)
MOLEX_WM5544-ND = drill 1.499: GND1 0,5.08; GND2 5.08,5.08; GND3 0,0; GND4 5.08,0; SIGNAL 2.54,2.54
2450BM = smd 0.35 x 1: 1 0.65,0.9; 2 0,0.9; 3 -0.65,0.9; 4 -0.65,-0.9; 5 0,-0.9; 6 0.65,-0.9
BAL-NRF01D3 = smd 0.22 x 0.22: ANT1 -0.537,-0.25; ANT2 -0.537,0.25; GND 0.069,0.25; SE 0.537,0; VCC 0.069,-0.25
0402_CAP = smd 0.536 x 0.546: 1 -0.433,0; 2 0.433,0
C0402 = smd 0.536 x 0.546: 1 -0.433,0; 2 0.433,0
C0603 = smd 1.1 x 1: 1 -0.85,0; 2 0.85,0
LED-0603 = smd 1 x 1: A 0,-0.877; C 0,0.877
TC2030-IDC = smd 0.787 x 0.787: 1 -1.27,-0.635; 2 -1.27,0.635; 3 0,-0.635; 4 0,0.635; 5 1.27,-0.635; 6 1.27,0.635 | hole 2.375: -2.54,2.54; 0.635,2.54; 0.635,-2.54; -2.54,-2.54 | hole 1.016: -2.54,0; 2.54,1.016; 2.54,-1.016
PTH-JUMPER-2-NO_NO_SILK = drill 1.016 pad 1.778: 1 -1.27,0; 2 1.27,0
0603_CAP = smd 0.7 x 1: 1 -0.65,0; 2 0.65,0
0603 = smd 1.1 x 1: 1 -0.85,0; 2 0.85,0
BBB_HEADERS = drill 1.016 octagon: P8_1 49.53,57.15; P8_2 52.07,57.15; P8_3 49.53,54.61; P8_4 52.07,54.61; P8_5 49.53,52.07; P8_6 52.07,52.07; P8_7 49.53,49.53; P8_8 52.07,49.53; P8_9 49.53,46.99; P8_10 52.07,46.99; P8_11 49.53,44.45; P8_12 52.07,44.45; P8_13 49.53,41.91; P8_14 52.07,41.91; P8_15 49.53,39.37; P8_16 52.07,39.37; P8_17 49.53,36.83; P8_18 52.07,36.83; P8_19 49.53,34.29; P8_20 52.07,34.29; P8_21 49.53,31.75; P8_22 52.07,31.75; P8_23 49.53,29.21; P8_24 52.07,29.21; P8_25 49.53,26.67; P8_26 52.07,26.67; P8_27 49.53,24.13; P8_28 52.07,24.13; P8_29 49.53,21.59; P8_30 52.07,21.59; P8_31 49.53,19.05; P8_32 52.07,19.05; P8_33 49.53,16.51; P8_34 52.07,16.51; P8_35 49.53,13.97; P8_36 52.07,13.97; P8_37 49.53,11.43; P8_38 52.07,11.43; P8_39 49.53,8.89; P8_40 52.07,8.89; P8_41 49.53,6.35; P8_42 52.07,6.35; P8_43 49.53,3.81; P8_44 52.07,3.81; P8_45 49.53,1.27; P8_46 52.07,1.27; P9_1 1.27,57.15; P9_2 3.81,57.15; P9_3 1.27,54.61; P9_4 3.81,54.61; P9_5 1.27,52.07; P9_6 3.81,52.07; P9_7 1.27,49.53; P9_8 3.81,49.53; P9_9 1.27,46.99; P9_10 3.81,46.99; P9_11 1.27,44.45; P9_12 3.81,44.45; P9_13 1.27,41.91; P9_14 3.81,41.91; P9_15 1.27,39.37; P9_16 3.81,39.37; P9_17 1.27,36.83; P9_18 3.81,36.83; P9_19 1.27,34.29; P9_20 3.81,34.29; P9_21 1.27,31.75; P9_22 3.81,31.75; P9_23 1.27,29.21; P9_24 3.81,29.21; P9_25 1.27,26.67; P9_26 3.81,26.67; P9_27 1.27,24.13; P9_28 3.81,24.13; P9_29 1.27,21.59; P9_30 3.81,21.59; P9_31 1.27,19.05; P9_32 3.81,19.05; P9_33 1.27,16.51; P9_34 3.81,16.51; P9_35 1.27,13.97; P9_36 3.81,13.97; P9_37 1.27,11.43; P9_38 3.81,11.43; P9_39 1.27,8.89; P9_40 3.81,8.89; P9_41 1.27,6.35; P9_42 3.81,6.35; P9_43 1.27,3.81; P9_44 3.81,3.81; P9_45 1.27,1.27; P9_46 3.81,1.27
R0402 = smd 0.536 x 0.546: 1 -0.433,0; 2 0.433,0
0603-RES = smd 0.7 x 1: 1 -0.65,0; 2 0.65,0
PAD-JUMPER-3-NO_YES_SILK_FULL_BOX = smd 1.168 x 1.6: 1 -1.524,0; 2 0,0; 3 1.524,0
PAD-JUMPER-2-NC_BY_TRACE_YES_SILK = smd 0.635 x 1.27: 1 -0.508,0; 2 0.508,0
TESTPOINT_0.040IN = drill 1.016: TESTPOINT 0,0
TP14SQ = smd 1.4 x 1.4: TP 0,0
S-PVQFN-N28 = smd 1 x 0.28: 1 -2.4,1.5; 2 -2.4,1; 3 -2.4,0.5; 4 -2.4,0; 5 -2.4,-0.5; 6 -2.4,-1; 7 -2.4,-1.5; 15 2.4,-1.5; 16 2.4,-1; 17 2.4,-0.5; 18 2.4,0; 19 2.4,0.5; 20 2.4,1; 21 2.4,1.5 | smd 0.28 x 1: 8 -1.5,-2.4; 9 -1,-2.4; 10 -0.5,-2.4; 11 0,-2.4; 12 0.5,-2.4; 13 1,-2.4; 14 1.5,-2.4; 22 1.5,2.4; 23 1,2.4; 24 0.5,2.4; 25 0,2.4; 26 -0.5,2.4; 27 -1,2.4; 28 -1.5,2.4 | smd 3.15 x 3.15: THERMALPAD 0,0
CAT24C256WI-GT3 = smd 2.2 x 0.6: A0 -2.6,1.91; A1 -2.6,0.65; A2 -2.6,-0.64; SCL 2.6,-0.64; SDA 2.6,-1.91; VCC 2.6,1.91; VSS -2.6,-1.91; WP 2.6,0.64
PVQFN-16 = smd 0.35 x 0.825: 1 -0.975,-2.013; 2 -0.325,-2.013; 3 0.325,-2.013; 4 0.975,-2.013; 9 0.975,2.013; 10 0.325,2.013; 11 -0.325,2.013; 12 -0.975,2.013 | smd 0.825 x 0.35: 5 2.013,-0.975; 6 2.013,-0.325; 7 2.013,0.325; 8 2.013,0.975; 13 -2.013,0.975; 14 -2.013,0.325; 15 -2.013,-0.325; 16 -2.013,-0.975 | smd 2.16 x 2.16: PAD 0,0
TSSOP16 = smd 0.9 x 0.35: 1 -2.875,2.275; 2 -2.875,1.625; 3 -2.875,0.975; 4 -2.875,0.325; 5 -2.875,-0.325; 6 -2.875,-0.975; 7 -2.875,-1.625; 8 -2.875,-2.275; 9 2.875,-2.275; 10 2.875,-1.625; 11 2.875,-0.975; 12 2.875,-0.325; 13 2.875,0.325; 14 2.875,0.975; 15 2.875,1.625; 16 2.875,2.275
QFN-48-6MM = smd 0.8 x 0.25: 1 -3,2.2; 2 -3,1.8; 3 -3,1.4; 4 -3,1; 5 -3,0.6; 6 -3,0.2; 7 -3,-0.2; 8 -3,-0.6; 9 -3,-1; 10 -3,-1.4; 11 -3,-1.8; 12 -3,-2.2; 25 3,-2.2; 26 3,-1.8; 27 3,-1.4; 28 3,-1; 29 3,-0.6; 30 3,-0.2; 31 3,0.2; 32 3,0.6; 33 3,1; 34 3,1.4; 35 3,1.8; 36 3,2.2 | smd 0.25 x 0.8: 13 -2.2,-3; 14 -1.8,-3; 15 -1.4,-3; 16 -1,-3; 17 -0.6,-3; 18 -0.2,-3; 19 0.2,-3; 20 0.6,-3; 21 1,-3; 22 1.4,-3; 23 1.8,-3; 24 2.2,-3; 37 2.2,3; 38 1.8,3; 39 1.4,3; 40 1,3; 41 0.6,3; 42 0.2,3; 43 -0.2,3; 44 -0.6,3; 45 -1,3; 46 -1.4,3; 47 -1.8,3; 48 -2.2,3 | smd 4.6 x 4.6: GND 0,0
NX2520SA = smd 1.2 x 1: 1 -0.85,-0.85; 2 0.85,-0.85; 3 0.85,0.85; 4 -0.85,0.85
TXC-8Y = smd 0.9 x 0.8: 1 -0.7,-0.55; 2 0.7,-0.55; 3 0.7,0.55; 4 -0.7,0.55

### Placement (x,y rotation side)
ANT1  15.24,2.03 0 top
ANT2  37.54,2.03 0 top
ANT3  40.39,56.13 0 top
B1  16.83,11.75 270 top
B2  36.07,58.67 0 top
C1  37.4,59.11 90 top
C2  40.53,15.88 0 top
C3  39.65,11.02 180 top
C4  38.95,29.48 270 top
C5  39.93,29.48 270 top
C6  40.09,14.12 90 top
C7  35.81,63.5 270 top
C8  31.75,63.5 90 top
C9  37.08,16.21 270 top
C10  31.24,31.24 180 top
C11  8.13,19.05 180 top
C12  8.13,14.22 180 top
C13  31.24,35.81 180 top
C14  44.7,19.68 270 top
C15  41.77,25.15 90 top
C16  43.31,22.61 0 top
C17  37.08,61.47 0 top
C18  29.72,63.5 90 top
C19  36.55,57.66 0 top
C20  35.56,55.63 270 top
C21  12.19,13.34 180 top
C22  21.59,13.72 270 top
C23  12.06,21.08 180 top
C24  21.59,19.05 0 top
C25  10.92,66.04 180 top
C26  35.56,30.73 180 top
C27  44.45,31.75 270 top
C28  35.81,38.86 180 top
C29  44.2,37.08 0 top
C30  24.89,55.37 270 top
C31  25.65,60.45 0 top
C32  11.94,11.43 180 top
C33  34.04,28.96 180 top
C34  34.04,24.51 180 top
C35  25.91,55.37 270 top
D1  40.64,70.87 180 top
D2  42.67,70.87 180 top
D3  44.7,70.87 180 top
D4  46.74,70.87 180 top
J1  27.35,48.03 0 top
J2  3.05,71.5 180 top
L1  38.52,27.83 0 top
L2  40.37,27.81 180 top
L3  39.94,26.15 90 top
L4  39.65,12.28 180 top
L5  38.35,17.5 270 top
L6  40.09,17.63 90 top
L7  38.95,26.14 90 top
L8  36.53,18.06 180 top
L9  25.65,58.93 0 top
L10  27.18,59.44 90 top
L11  34.04,26.42 0 top
L12  10.16,22.61 180 top
L13  35.31,41.4 180 top
P9/P8  0.64,8.89 0 top
R1  40.64,67.82 90 top
R2  42.67,67.82 90 top
R3  44.7,67.82 90 top
R4  46.74,67.82 90 top
R5  33.02,22.61 180 top
R6  33.02,20.83 180 top
R7  45.49,21.67 180 top
R8  13.46,66.04 180 top
R9  13.46,64.14 180 top
R10  13.46,62.23 180 top
R11  10.92,62.23 0 top
R12  10.92,64.14 0 top
R13  7.87,69.09 90 top
R14  23.62,37.85 0 top
R15  22.35,39.12 0 top
R16  22.35,41.15 0 top
R17  34.17,53.38 0 top
R18  21.59,15.43 180 top
R19  44.2,33.78 180 top
R20  33.02,19.05 180 top
R21  18.92,21.34 180 top
R22  43.94,42.16 180 top
SJ1  18.16,65.91 0 top
SJ2  18.29,33.27 180 top
TP0  13.21,33.53 0 top
TP1  27.18,40.51 0 top
TP2  20.32,51.82 0 top
TP3  21.59,33.27 0 top
TP4  16,42.42 0 top
U1  16.83,16.83 270 top
U2  39.43,35 270 top
U3  13.72,70.36 180 top
U4  39.78,21.34 180 top
U5  17.02,37.59 0 top
U6  31.54,58.29 0 top
U$2  [UMICH_SOLID_200MIL]  5.08,3.05 0 top
X1  9.65,16.64 90 top
X2  32.73,33.53 90 top
X3  33.53,63.5 180 top

### Tracks (layer width: path | path; a pad name or v marks a point on that pad's centre or on a via)
5V
  Top 0.406: P9/P8.P9_7 P9/P8.P9_8
!RESET0  (via drill 0.41)
  Top 0.203: v22.1,17.27 21.65,16.83 U1.25 | v21.08,21.08 21.08,21.84 20.32,22.61 16.76,22.61 10.92,28.45 10.92,39.37 8.64,41.66 8.64,42.67 9.65,43.69 9.65,48.13 P9/P8.P9_12
  Bottom 0.203: v22.1,17.27 22.1,20.07 v21.08,21.08
!RESET1  (via drill 0.41)
  Top 0.203: U2.25 44.15,35 v44.39,35.24
  Bottom 0.203: v44.39,35.24 48.07,35.24 49.02,34.29 51.44,34.29 P9/P8.P8_26
!RESET2
  Top 0.203: U6.8 8.42,57.69 5.33,54.61 3.17,54.61 P9/P8.P9_11
AVDD  (via drill 0.41)
  Top 0.203: C17.1 36.07,61.47 v35.56,60.96 35.09,60.49 | 35.05,60.45 35.05,60.2 34.95,60.09 U6.35 | 35.09,60.49 U6.36 35.01,60.49 35.05,60.45 | 35.05,60.45 35.09,60.49 | v25.15,61.47 25.15,60.53 C31.1 L9.1
  Bottom 0.203: v35.56,60.96 25.65,60.96 v25.15,61.47
BIRQ  (via drill 0.41)
  Top 0.203: v12.19,48.26 12.7,48.26 19.3,54.86 20.83,54.86 22.46,56.49 U6.11
  Bottom 0.203: v12.19,48.26 P9/P8.P9_16
CCA0
  Top 0.203: U1.6 15.83,20.49 6.86,29.46 6.86,45.47 5.33,46.99 3.17,46.99 P9/P8.P9_15
CCA1
  Top 0.203: U2.6 38.43,40.72 47.24,49.53 51.44,49.53 P9/P8.P8_14
CS  (via drill 0.41)
  Top 0.203: P9/P8.P9_17 1.91,44.83 3.05,43.69 3.05,42.67 3.81,41.91 v6.1,41.91 | v9.65,41.91 10.16,41.91 13.46,38.61 13.97,38.61 | 13.97,38.61 14.1,38.61 | U5.3 13.97,38.57 13.97,38.61
  Bottom 0.203: v6.1,41.91 v9.65,41.91
CS0  (via drill 0.41)
  Top 0.203: U1.3 17.33,20.01 7.87,29.46 7.87,30.23 v8.13,30.48 | U5.13 19.96,37.85 v21.84,37.85 R14.1
  Bottom 0.203: 12.7,34.8 20.83,34.8 20.83,37.08 21.59,37.85 v21.84,37.85 | 12.7,34.8 12.45,34.8 v8.13,30.48 | TP0.TESTPOINT 13.21,34.29 12.7,34.8
CS1  (via drill 0.41)
  Top 0.203: U2.3 39.93,39.42 v40.89,40.39 | U5.14 21.15,38.57 R15.1 21.84,39.26 21.84,39.62 v22.35,40.13
  Bottom 0.203: v40.89,40.39 39.88,41.4 26.67,41.4 | 26.67,41.4 23.62,41.4 v22.35,40.13 | TP1.TESTPOINT 27.18,40.89 26.67,41.4
CS2
  Top 0.203: 21.7,52.18 22.35,52.83 29.46,52.83 30.94,54.31 U6.17 | U5.15 20.42,39.22 21.92,40.72 R16.1 21.7,52.18 | TP2.TESTPOINT 21.34,51.82 21.7,52.18
CSE0
  Top 0.203: P9/P8.P8_11 43.69,53.34 25.91,35.56 21.84,35.56 20.79,36.62 U5.11
CSE1
  Top 0.203: P9/P8.P8_12 51.44,52.07 43.18,52.07 26.16,35.05 21.59,35.05 20.68,35.97 U5.10
DCC
  Top 0.203: U6.2 L10.2
EN
  Top 0.203: U2.10 36.44,35.5 35.88,36.07 35.31,36.07 34.29,37.08 29.72,37.08 28.7,36.07 28.7,24.5 32.37,20.83 R6.2
FIFO0
  Top 0.203: U1.9 13.67,17.83 11.43,20.07 8.64,20.07 5.84,22.86 5.84,30.99 5.08,31.75 3.17,31.75 P9/P8.P9_27
FIFO1  (via drill 0.41)
  Top 0.203: U2.9 36.58,36 35.31,37.27 v35.31,37.34 | P9/P8.P8_16 51.44,46.99 49.53,46.99 48.77,46.23 48.77,44.2 v45.21,40.64
  Bottom 0.203: v35.31,37.34 36.07,38.1 36.83,38.1 38.1,36.83 41.4,36.83 v45.21,40.64
FIFOP0
  Top 0.203: U1.7 15.33,20.49 6.35,29.46 6.35,36.07 5.59,36.83 3.17,36.83 P9/P8.P9_23
FIFOP1
  Top 0.203: P9/P8.P8_13 47.75,50.8 37.93,40.98 U2.7
GND  (via drill 0.41)
  Top 0.203: 34.65,59.29 U6.33 35.04,59.29 35.18,59.44 35.18,59.56 35.05,59.69 U6.34 36.14,59.69 37.25,59.69 C1.2 37.4,60.52 37.59,60.71 38.35,60.71 v38.61,60.96 | C19.2 36.99,56.99 v37.59,56.39 | U6.13 27.61,55.29 v27.43,55.12 | J1.5 28.62,47.07 v31.5,44.2 | R21.1 19.3,21.34 19.3,20.57 v19.05,20.32
  Top 0.305: 36.13,59.29 36.13,58.93 B2.GND 36.14,59.69
  Top 0.356: B1.2 19.62,11.75 19.81,11.94 v19.81,12.45
  Top 0.406: U4.PAD 39.78,22.1 | R19.1 45.85,33.78 v45.91,33.72
  other vias: 23.24,15.62 42.99,21.04 9.65,21.08 9.78,24.51 7.37,24.13 8.64,25.4 7.37,26.92 9.91,12.7 8.89,11.68 7.37,11.94 7.37,15.75 7.37,17.53 10.41,9.14 8.64,10.16 13.21,7.11 15.75,9.65 15.75,8.64 19.81,9.65 19.81,10.67 19.81,8.64 19.81,5.08 19.81,4.06 17.27,2.29 18.29,2.29 15.75,5.08 15.75,4.06 14.73,4.57 17.78,1.27 20.83,4.57 14.22,12.45 14.22,11.18 14.48,8.89 13.21,8.38 13.21,5.84 13.21,4.57 13.21,3.3 13.21,2.03 13.21,1.02 22.35,1.02 22.35,2.03 22.35,3.3 22.35,4.57 22.35,5.84 22.35,7.11 14.48,9.91 21.08,9.14 22.35,9.65 21.84,11.94 21.08,10.41 20.57,11.43 8.38,2.54 3.56,5.33 2.79,7.37 11.18,1.27 8.13,31.75 12.19,28.7 13.21,27.69 14.22,26.67 15.49,25.4 16.76,24.38 18.29,23.62 20.32,23.62 22.1,22.86 22.86,20.83 23.88,18.8 25.4,16.76 25.15,13.97 24.13,12.7 24.13,22.61 25.15,20.32 25.65,18.29 26.92,15.24 26.42,11.94 24.13,11.18 23.11,12.19 11.94,8.89 6.86,8.89 12.19,35.81 8.13,37.08 15.49,33.78 8.13,34.54 31.75,11.43 28.45,9.4 33.78,8.38 23.75,9.4 33.78,5.08 24.38,1.02 33.53,1.02 35.31,1.02 35.31,2.03 35.31,4.57 35.31,5.84 35.31,7.11 35.31,8.38 37.85,9.65 43.94,9.91 38.05,5.09 38.05,4.08 37.03,4.58 39.57,2.55 40.59,2.55 40.08,1.54 42.67,8.64 43.13,4.58 42.11,5.09 42.11,4.08 44.45,4.57 44.45,5.84 44.45,7.11 44.45,3.3 44.45,2.03 35.31,3.3 42.67,9.91 42.67,11.18 42.67,12.45 42.67,13.72 42.67,14.99 42.16,17.02 43.18,17.02 43.18,18.29 37.59,10.92 37.59,12.19 37.59,13.46 37.59,14.48 36.58,14.48 30.99,15.24 34.04,15.49 34.04,13.21 44.2,10.92 44.45,13.46 46.48,16 45.97,12.45 46.74,9.65 49.02,7.37 45.47,5.84 46.99,2.54 51.05,6.1 45.72,1.78 28.96,1.02 31.5,9.14 25.91,9.4 35.31,9.65 36.58,8.89 36.58,13.46 47.5,6.86 30.73,17.27 30.23,21.84 28.7,18.8 28.45,21.84 27.94,23.37 29.72,25.15 29.97,29.46 29.72,34.54 27.43,33.78 27.69,30.23 24.38,33.78 12.7,37.08 23.62,27.69 27.18,38.61 28.96,40.39 32.51,38.1 43.94,24.64 45.21,22.86 47.5,23.88 46.23,18.29 44.7,16 41.15,26.8 44.2,29.46 42.93,30.73 41.4,28.96 42.67,28.7 43.69,26.67 47.5,20.57 37.59,24.38 36.07,24.89 37.59,26.8 35.94,26.73 35.05,32.26 37.08,28.96 8.64,46.74 22.86,43.94 18.8,43.94 38.1,44.7 40.39,46.99 47.24,44.45 45.47,44.2 41.91,46.99 42.67,49.78 46.99,46.99 47.5,41.4 47.24,40.13 47.5,38.1 46.48,37.08 46.99,30.23 47.5,32.51 46.48,28.19 46.99,25.15 29.21,12.95 16.83,16.83 17.84,16.83 17.84,17.84 16.83,17.84 15.81,17.84 15.81,16.83 15.81,15.81 16.83,15.81 17.84,15.81 39.78,21.34 39.01,22.1 40.54,22.1 39.01,20.57 40.54,20.57 38.42,36.07 39.43,36.07 40.45,36.07 38.42,34.99 39.43,34.99 40.45,34.99 38.42,33.91 39.43,33.91 40.45,33.91 8.64,7.87 10.16,2.29 24.13,6.1 27.69,26.92 11.94,30.23 29.72,32.26 32.13,29.97 29.72,27.18 45.97,38.23 45.21,39.37 44.2,27.94 32.26,25.4 32.45,23.69 44.2,49.78 39.62,44.7 38.61,56.39 42.16,60.96 43.69,60.96 42.93,61.72 44.96,59.44 44.96,57.91 45.72,58.67 42.16,56.39 43.69,56.39 42.93,55.63 30.1,59.94 31.62,59.94 33.15,59.94 30.1,58.29 31.62,58.29 33.15,58.29 30.1,56.64 31.62,56.64 33.15,56.64 22.61,55.37 12.45,56.64 15.49,56.64 14.99,65.02 7.62,65.02
  pour Bottom (isolate 0.305): 0,73.41 54.61,73.41 54.61,0 0,0
  pour Top: 54.61,73.41 0,73.41 0,0.02 5.2,0 16,0 16,12.45 19.56,12.45 19.6,0 38.1,0 38.1,9.65 38.86,10.41 38.86,12.83 38.35,13.46 38.35,18.54 37.85,18.54 37.85,32.77 40.89,32.77 40.89,18.8 41.66,18.8 41.66,17.08 41.08,16.51 41.08,15.24 41.15,15.18 41.91,14.48 41.91,0 54.61,0 54.61,56.9 34.8,56.9 34.8,60.45 54.61,60.45
  pour GND: 0,0 54.61,0 54.61,73.41 0,73.41
  pour Top: 19.3,11.94 19.3,3.05 16.26,3.05 16.26,11.94 14.48,11.94 14.48,0 21.08,0 21.08,11.94
  pour Top (no thermals): 36.32,0 36.32,16.51 38.73,16.51 38.73,13.21 39.5,12.83 39.5,10.46 38.57,9.78 38.57,0
  pour Top (no thermals): 41.59,0 41.59,14.67 40.7,15.24 40.7,16.51 41.47,17.08 41.47,18.8 45.47,18.8 45.47,0
  pour Top: 38.1,0 41.91,0 42.11,3.06 38.3,3.06
  pour Top: 36.83,19.05 41.91,19.05 41.91,20.83 36.83,20.83
  pour Top (no thermals): 38.35,22.58 38.35,31.98 36.83,32 36.83,22.61 38.1,22.61
  pour Top (no thermals): 40.55,31.99 40.55,22.59 41.91,22.61 41.91,32
  pour Top: 16,0 16,2.79 19.56,2.79 19.56,0
  pour Top: 54.61,60.71 34.8,60.71 34.8,60.2 44.45,60.2 44.45,57.15 34.8,57.15 34.8,56.64 54.61,56.64
LED0  (via drill 0.41)
  Top 0.406: v48.77,61.47 45.97,64.26 41.4,64.26 40.64,65.02 R1.1
  Bottom 0.406: P9/P8.P8_19 48.77,44.58 v48.77,61.47
LED1  (via drill 0.41)
  Top 0.406: v51.44,62.23 49.15,62.23 46.35,65.02 43.43,65.02 42.67,65.79 R2.1
  Bottom 0.406: v51.44,62.23 51.44,46.99 P9/P8.P8_17
LED2
  Top 0.406: P9/P8.P8_18 53.85,46.86 53.85,64.26 53.34,64.77 48.01,64.77 46.99,65.79 45.21,65.79 44.7,66.29 R3.1
MISO  (via drill 0.41)
  Top 0.203: U1.1 18.33,21.28 R21.2 17.02,21.34 9.4,28.96 v9.4,39.62 | 43.43,42.02 R22.2 43.51,40.97 v42.93,40.39 40.93,38.39 U2.1 | v11.18,42.16 11.68,42.67 11.68,46.23 19.3,53.85 29.46,53.85 30.14,54.53 U6.15
  Bottom 0.203: v42.93,40.39 40.89,42.42 11.43,42.42 v11.18,42.16 9.4,40.39 | 9.4,40.39 6.6,40.39 5.08,41.91 3.17,41.91 P9/P8.P9_21 | v9.4,39.62 9.4,40.39
MOSI  (via drill 0.41)
  Top 0.203: U1.2 17.83,20.02 8.89,28.96 8.89,39.12 7.87,40.13 7.87,42.93 v8.64,43.69 | U2.2 40.43,38.65 41.91,40.13 v41.91,42.42 | U6.14 29.74,54.63 29.46,54.36 19.3,54.36 v10.67,45.72
  Bottom 0.203: P9/P8.P9_18 6.6,45.72 v8.64,43.69 | v8.64,43.69 9.4,42.93 41.4,42.93 v41.91,42.42 | v10.67,45.72 v8.64,43.69
N$1
  Top 0.406: R1.2 D1.C
N$2
  Top 0.406: R2.2 D2.C
N$3
  Top 0.406: R3.2 D3.C
N$5  (via drill 0.41)
  Top 0.203: U1.24 23.95,16.33 24.13,16.51
  Top 0.406: U1.26 20.82,17.33 21.59,18.1 22.54,18.1 24.13,16.51 24.13,15.24 23.11,14.22 v20.32,14.22 | U1.20 17.83,13.67 18.03,13.46 19.56,13.46 v20.32,14.22 | U1.22 19.23,15.32 v20.32,14.22 | U1.16 15.83,13.8 15.49,13.46 12.97,13.46 | v20.32,14.22 21.45,14.22 C22.1 | U1.11 13.4,16.83 v13.21,17.02 | U1.8 14.43,18.85 v14.22,19.05 14.22,20.57 13.72,21.08 C23.1 12.5,21.79 11.94,22.35 11.26,22.35 L12.1 | 12.84,11.48 C32.1 12.62,11.59 C21.1 12.84,13.34 12.97,13.46 | U1.14 14.06,15.33 v13.21,14.48 12.97,14.24 12.97,13.46
  Bottom 0.406: v20.32,14.22 20.07,14.48 v13.21,14.48 v13.21,17.02 13.21,18.8 13.46,19.05 v14.22,19.05
N$7
  Top 0.356: ANT1.SIGNAL 17.78,11.04 B1.1
N$11
  Top 0.203: U1.13 10.54,15.83 X1.1 10.5,15.07 9.65,14.22 C12.1
N$12
  Top 0.203: U1.27 19.93,17.83 C24.1
N$13
  Top 0.203: U1.12 12.37,16.33 11.68,17.02 11.68,18.03 11.18,18.54 9.86,18.54 X1.3 | 8.78,17.51 X1.3 | C11.1 8.56,17.73 X1.3
N$14
  Top 0.203: U1.23 20.76,15.83 R18.2
N$29
  Top 0.406: R8.1 16.51,66.04 SJ1.1 16.64,68.13 U3.A0
N$30
  Top 0.406: U3.A1 15.67,69.6 17.78,69.6 19.68,67.69 SJ1.3 19.68,64.9 18.92,64.14 R9.1
N$31  (via drill 0.41)
  Top 0.203: U3.WP 7.89,69.72 R13.2 7.73,69.6 v6.6,69.6
  Bottom 0.203: v6.6,69.6 6.22,69.6 J2.1
N$32  (via drill 0.41)
  Top 0.406: U3.A2 v18.54,70.99 | R10.1 16.76,62.23 v17.02,62.48
  Bottom 0.406: v17.02,62.48 18.54,64.01 v18.54,70.99
N$36
  Top 0.203: U6.31 35.46,58.49 B2.ANT1
N$37
  Top 0.203: U6.32 35.5,58.89 B2.ANT2
N$38
  Top 0.406: ANT3.SIGNAL B2.SE C1.1
N$39
  Top 0.203: 26.2,58.79 L9.2 26.23,58.79 L10.1
N$40
  Top 0.203: U6.37 33.74,61.68 34.04,61.98 34.54,61.98 35.05,62.48 35.05,63.5 34.8,63.75 | 34.8,63.75 34.52,63.75 X3.1 | 34.8,63.75 34.98,63.93 C7.1
N$41
  Top 0.203: U6.38 33.34,61.91 33.02,62.23 33.02,62.76 X3.3 31.87,62.95 C8.1
N$42
  Top 0.203: U6.39 32.94,61.8 32.51,62.23 30.55,62.23 C18.1
N$43
  Top 0.203: U6.29 35.02,57.69 35.56,57.15 C20.1
N$44
  Top 0.356: U4.4 38.8,25.55 L7.1
N$45
  Top 0.356: U4.2 40.1,25.56 L3.1
N$46
  Top 0.508: C5.2 L2.2 L3.2
N$47
  Top 0.508: C4.2 L1.2 L7.2
N$48
  Top 0.203: L8.1 37.85,18.06 38.26,18.06 | 38.26,18.06 L5.1 | U4.10 39.45,18.85 38.66,18.06 38.26,18.06
N$49  (via drill 0.41)
  Top 0.203: U4.13 44.68,20.36 C14.1 44.73,20.36 46.19,20.36 v46.23,20.32 | v34.76,18.06 L8.2 | U4.16 42.58,22.31 C16.1
  Top 0.406: C16.1 42.87,24.44 v42.8,24.51 42.6,24.71 C15.1 41.77,24.37 U4.1 | v36.07,23.62 35.36,23.62 C34.1 L11.2
  Bottom 0.356: v42.8,24.51 42.8,24 43.18,23.62
  Bottom 0.406: v46.23,20.32 46.74,20.83 46.74,22.61 45.72,23.62 43.18,23.62 v36.07,23.62 34.76,22.31 v34.76,18.06
N$50
  Top 0.203: C9.1 37.08,16.94 37.21,17.07 L5.2
N$51
  Top 0.356: U4.11 L6.2
N$52
  Top 0.356: C3.1 ANT2.SIGNAL
  Top 0.508: C6.1 40.09,12.29 L4.1 C3.1
N$53
  Top 0.508: L6.1 C2.1 C6.2
N$54
  Top 0.203: 44.84,21.66 R7.2 44.79,21.72 41.69,21.72 U4.15
N$55
  Top 0.203: U4.5 33.97,22.31 33.67,22.61 R5.1
N$56
  Top 0.203: U4.6 34.5,21.66 33.67,20.83 R6.1
N$57  (via drill 0.41)
  Top 0.203: U2.24 46.52,34.5 46.74,34.29
  Top 0.406: U2.20 40.43,31.96 40.89,31.5 41.91,31.5 v42.16,31.75 42.67,32.26 | U2.22 42.44,33.5 42.67,33.27 42.67,32.26 | 42.67,32.26 44.38,32.26 C27.1 44.78,32.51 45.97,32.51 46.74,33.27 46.74,34.29 44.96,36.07 43.69,36.07 43.12,35.5 U2.26 | U2.11 35.86,35 v35.56,35.31 | U2.8 37.03,36.88 v36.58,37.34 36.58,38.53 C28.1 36.25,41.31 L13.1 36.46,41.4 | v36.58,32 35.99,31.42 C26.1 35.99,30.06 C33.1 | U2.14 37.03,32.46 v36.58,32 | v36.58,32 37.08,31.5 38.04,31.5 38.43,31.89 U2.16
  Bottom 0.406: v42.16,31.75 41.15,32.77 37.34,32.77 | v36.58,37.34 36.58,35.31 | 36.58,35.31 36.58,33.53 37.34,32.77 | v35.56,35.31 36.58,35.31 | 37.34,32.77 v36.58,32
N$58
  Top 0.203: U2.27 42.46,36 C29.1
N$59
  Top 0.203: U2.13 34.91,34 X2.1 33.58,32.31 32.77,31.5 31.93,31.5 C10.1
N$60
  Top 0.203: U2.12 35.09,34.5 34.29,35.31 32.81,35.31 X2.3 31.88,35.8 C13.1
N$61
  Top 0.203: U2.23 43.54,34 R19.2
N$62
  Top 0.203: R20.1 33.67,19.05 35.63,21.01 U4.7
N$63
  Top 0.406: R4.2 D4.C
N$64  (via drill 0.41)
  Top 0.203: v31.75,53.85 U6.19
  Top 0.406: v48.01,66.29 46.91,67.39 R4.1
  Bottom 0.406: v31.75,53.85 32.26,53.34 46.74,53.34 48.01,54.61 v48.01,66.29
N$65
  Top 0.203: SJ2.1 19.05,33.27 19.81,34.04 19.81,35.24 U5.9
N$66  (via drill 0.41)
  Top 0.203: U5.12 21.15,37.27 v22.1,36.32 | v23.11,33.78 23.11,33.27 22.86,33.02 21.84,33.02 TP3.TP
  Bottom 0.203: v22.1,36.32 23.11,35.31 v23.11,33.78
N$67
  Top 0.203: U5.1 14.22,39.95 15.31,39.95 16,40.64 TP4.TP
PAEN  (via drill 0.41)
  Top 0.203: v31.24,27.43 31.24,23.73 32.37,22.61 R5.2 | U2.4 39.43,39.94 v39.75,40.26
  Bottom 0.203: v31.24,27.43 31.24,35.05 36.45,40.26 v39.75,40.26
RF_N
  Top 0.254: U1.19 17.33,12.8 B1.3
RF_N2
  Top 0.152: U2.19 C5.1
RF_P
  Top 0.254: U1.17 16.33,12.8 B1.4
RF_P2
  Top 0.152: 38.95,32.6 C4.1
  Top 0.203: U2.17 38.95,32.6
SCL
  Top 0.203: 5.84,60.96 5.84,57.91 5.08,57.15 1.27,57.15 0.76,56.64 0.76,44.32 P9/P8.P9_19 | 5.84,60.96 5.84,70.23 6.61,71 U3.SCL | R11.1 7.11,62.23 5.84,60.96
SCLK  (via drill 0.41)
  Top 0.203: U1.28 19.23,19.48 20.32,20.57 20.32,21.84 20.07,22.1 16.76,22.1 9.91,28.96 9.91,37.08 v10.16,37.34 | U2.28 41.83,38.28 v42.67,39.12 | v12.19,41.4 12.19,46.23 19.3,53.34 29.46,53.34 30.54,54.42 U6.16
  Bottom 0.203: 9.65,38.86 6.22,38.86 P9/P8.P9_22 | v10.16,37.34 10.16,38.35 9.65,38.86 | v42.67,39.12 42.67,39.62 40.39,41.91 12.7,41.91 v12.19,41.4 9.65,38.86
SDA  (via drill 0.41)
  Top 0.203: U3.SDA 9.78,72.27 v9.4,71.88 | R12.1 9.53,64.14 v9.14,63.75
  Bottom 0.203: v9.4,71.88 9.4,64.01 v9.14,63.75 9.14,61.21 5.08,57.15 4.06,57.15 3.05,56.13 3.05,44.58 P9/P8.P9_20
SFD0
  Top 0.203: U1.5 16.33,20.5 7.37,29.46 7.37,47.88 P9/P8.P9_14
SFD1
  Top 0.203: U2.5 38.93,40.46 46.74,48.26 P9/P8.P8_15
SWDCLK
  Top 0.203: U6.24 33.74,53.38 | 33.74,53.38 R17.1 | 33.74,53.38 33.74,50.51 31.27,48.03 27.94,48.03 27.35,48.62 J1.4
SWDIO
  Top 0.203: J1.2 26.42,49 26.42,51.56 27.18,52.32 31.24,52.32 33.34,54.42 U6.23
UARTRX  (via drill 0.41)
  Top 0.203: U6.9 20.72,57.29 v20.32,56.9 | v13.21,44.2 v13.21,41.15
  Bottom 0.203: v20.32,56.9 13.21,49.78 v13.21,44.2 | v13.21,41.15 13.21,39.37 10.16,36.32 6.22,36.32 P9/P8.P9_24
UARTTX  (via drill 0.41)
  Top 0.203: U6.10 21.33,56.89 v20.32,55.88 | v14.22,44.2 v14.22,41.15
  Bottom 0.203: v20.32,55.88 14.22,49.78 v14.22,44.2 | P9/P8.P9_26 9.91,35.56 14.22,39.88 v14.22,41.15
VCC  (via drill 0.41)
  Top 0.203: U3.VCC 7.88,68.45 | R13.1 7.87,67.56 v7.62,67.31 | v20.07,41.15 20.07,40.04 U5.16 | U6.1 28.15,60.49 v26.92,61.72 | J1.1 25.55,47.4 25.27,47.12 v22.61,47.12 | U6.12 26.2,56.09 C35.1 C30.1 | R14.2 24.05,38.43 23.37,39.12 | 23.37,39.12 R15.2 | R16.2 23.37,41.15 v24.38,40.13 23.37,39.12 | R20.2 32.32,18.79 v32.32,17.78
  Top 0.254: C30.1 24.18,55.8 v24,55.63 | 7.88,68.45 R13.1
  Top 0.406: L12.2 8.13,22.61 v7.87,22.86 | L11.1 33.34,26.42 v33.34,27.56 | L13.2 34.54,41.4 v34.54,40.13 | C25.1 R8.2 R9.2 R10.2 R11.2 | R12.2 C25.1 | D1.A arc45 40.62,71.73 v39.75,70.87 | D2.A arc45 42.44,71.64 v41.66,70.87 | D3.A 44.56,71.74 v43.69,70.87 | D4.A 46.6,71.74 v45.72,70.87 | C25.1 11.36,68.21 U3.VCC
  pour VCC: 0,0 54.61,0 54.61,73.41 0,73.41
VDD
  Top 0.406: P9/P8.P9_6 P9/P8.P9_5
VDD_PA
  Top 0.203: B2.VCC 36.14,57.67 C19.1 35.69,57.66 35.25,58.09 U6.30

### Text on the board
tPlace: EEPROM / WRITE | nRF-CS | CC1-CS | CC0-CS | ZigBeag | RevC | N.Jackson | 2014/11/20
tNames: P9 | P8 | GND | 3V3 | 5V | SYS_5V | !RST0 | CSE0 | CSE1 | SFD0 | FIFOP1 | CCA1 | CCA0 | BIRQ | SFD1 | FIFO1 | CS0 | SI | LD1 | LD2 | SCL | SDA | LD0 | SO | SPICL | FIFP0 | !RST1 | FIFO0
tDocu: CE1 | RXD | TXD | SCL | SDA